# EAGLE board haasoscope_pro_fpga_board - before autoroute (EAGLE 9.6.2), part 1 of 2
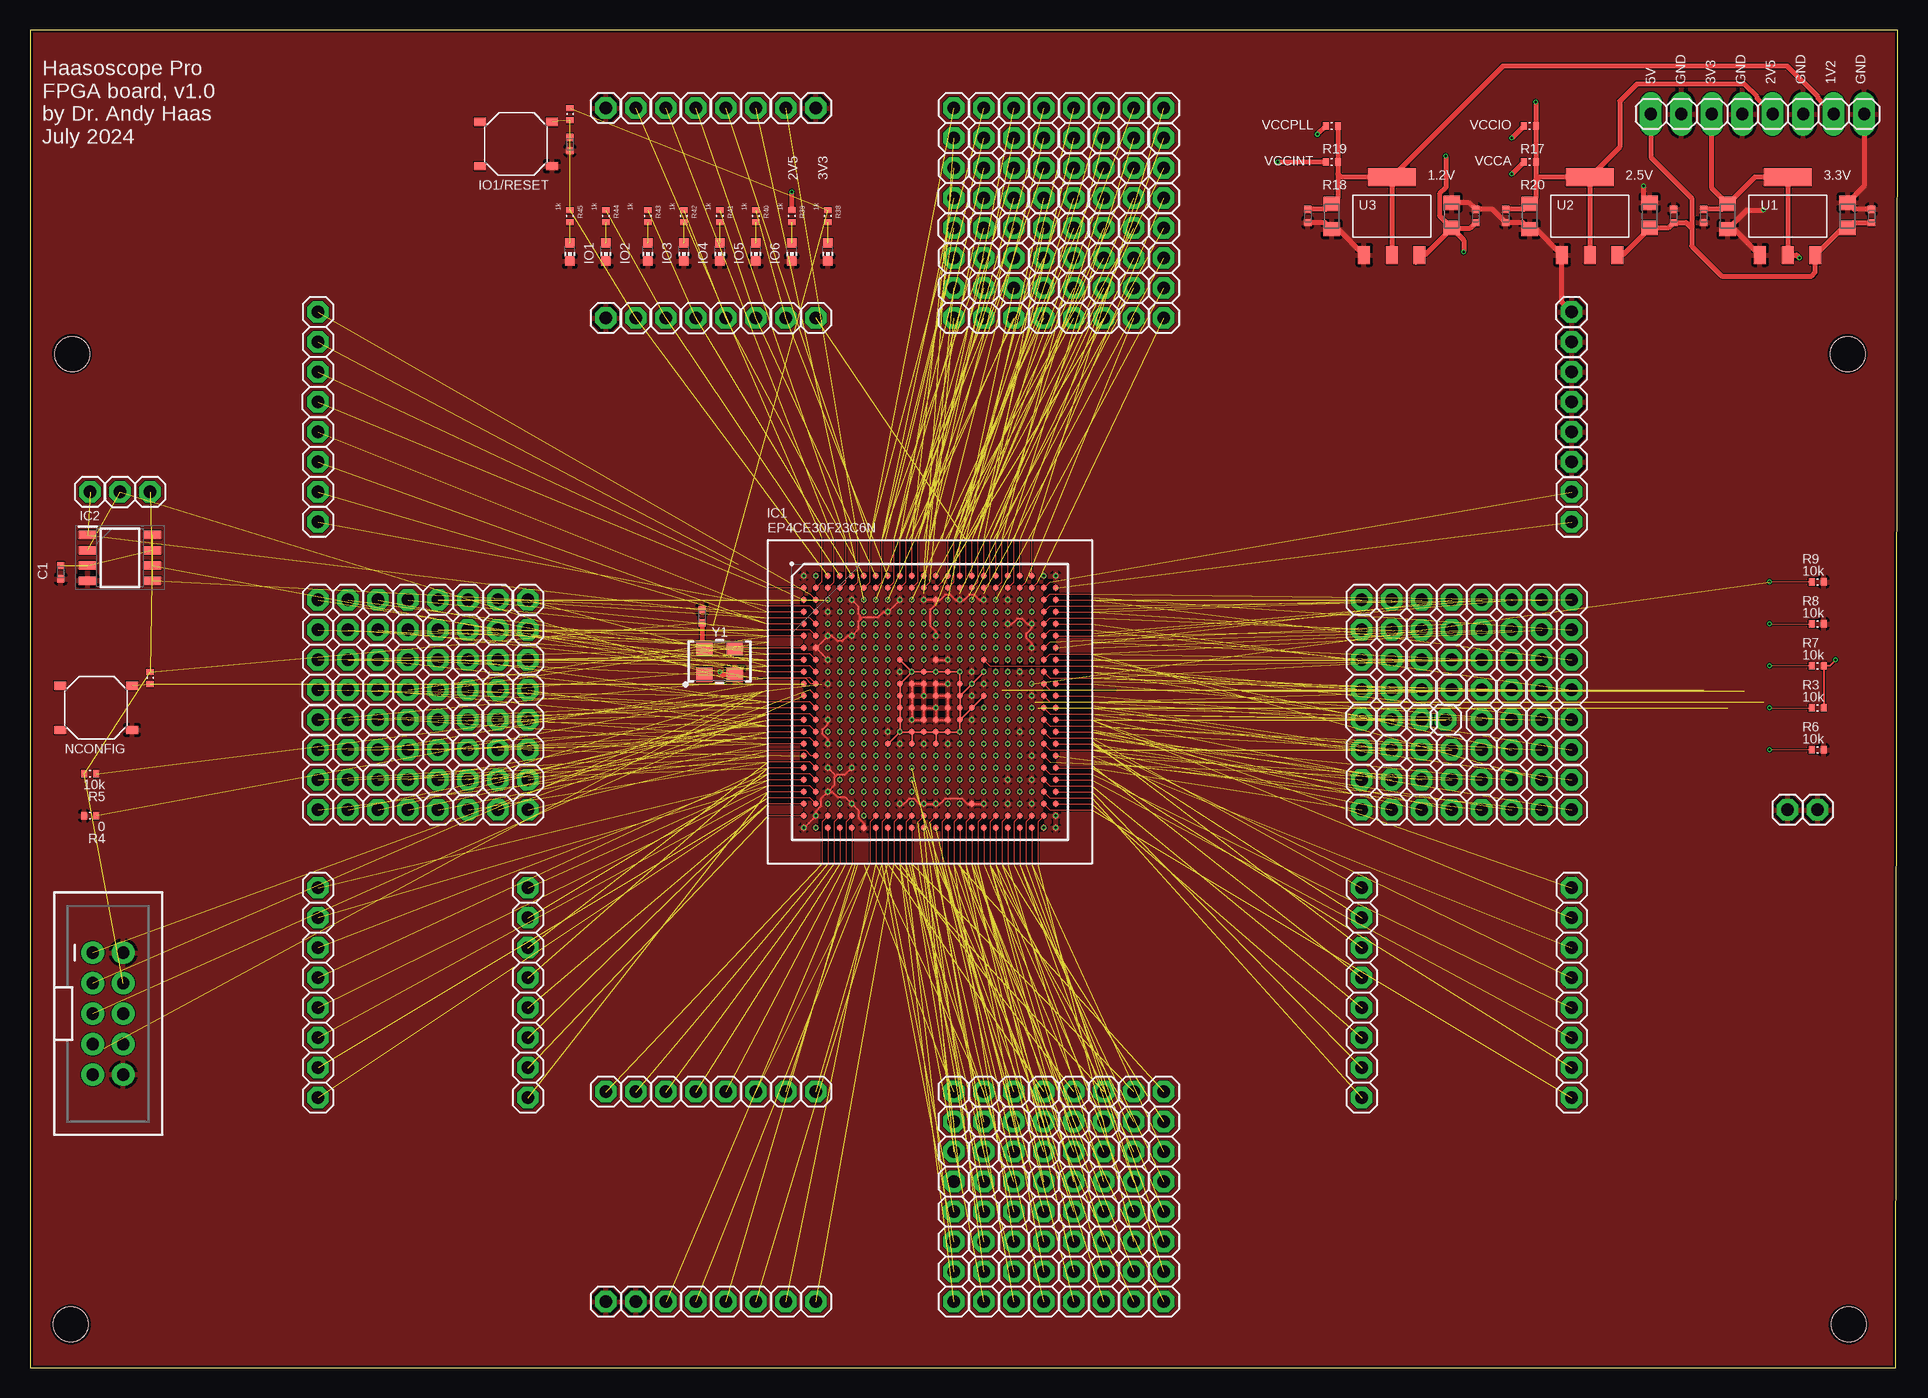
[diagram p4: board, top side]
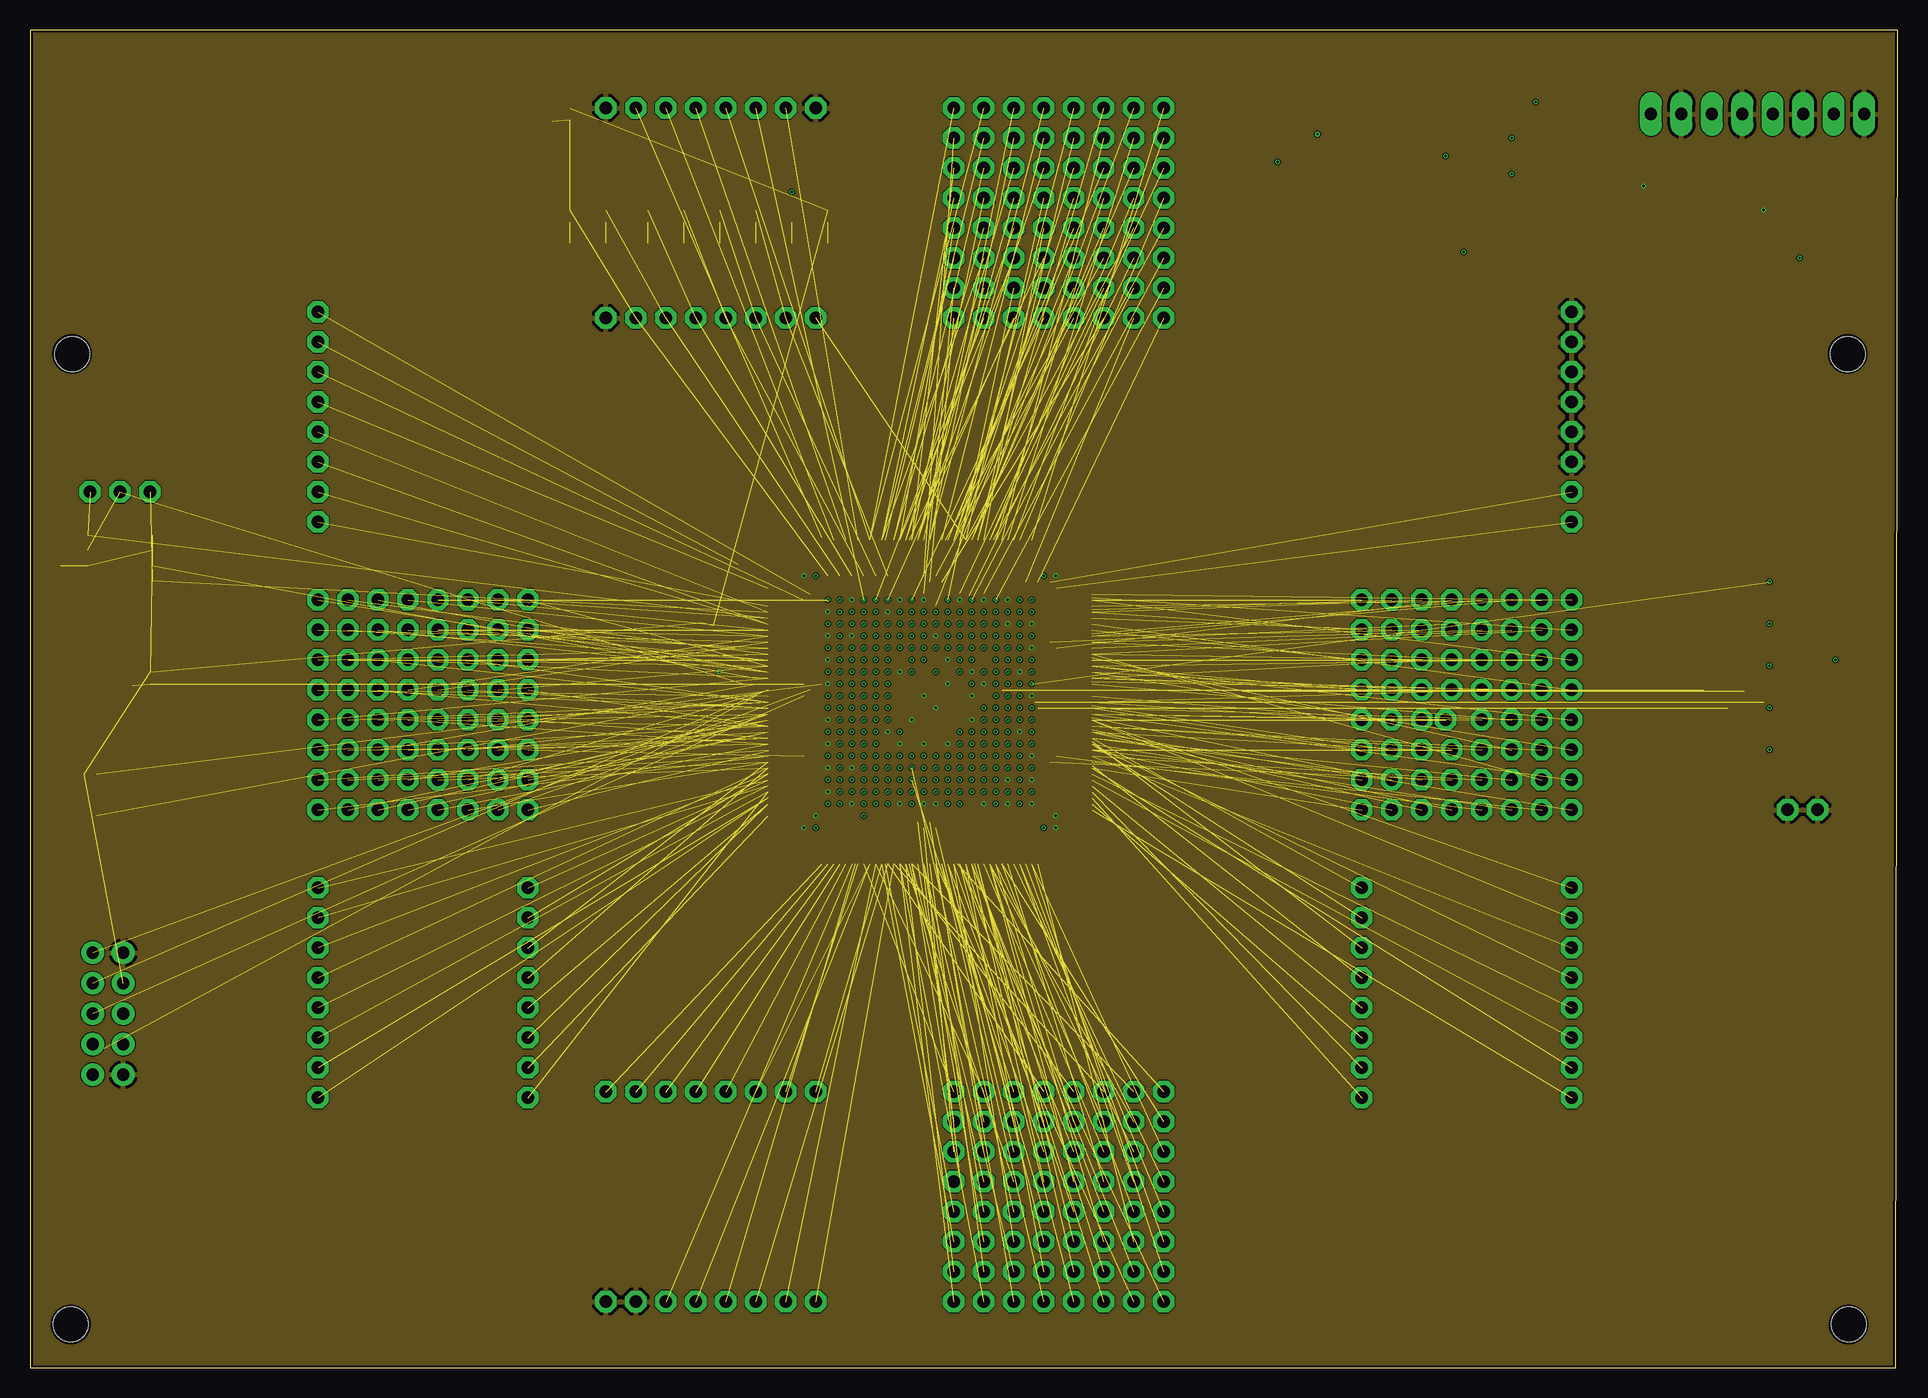
[diagram p5: board, inner layer topgnd]
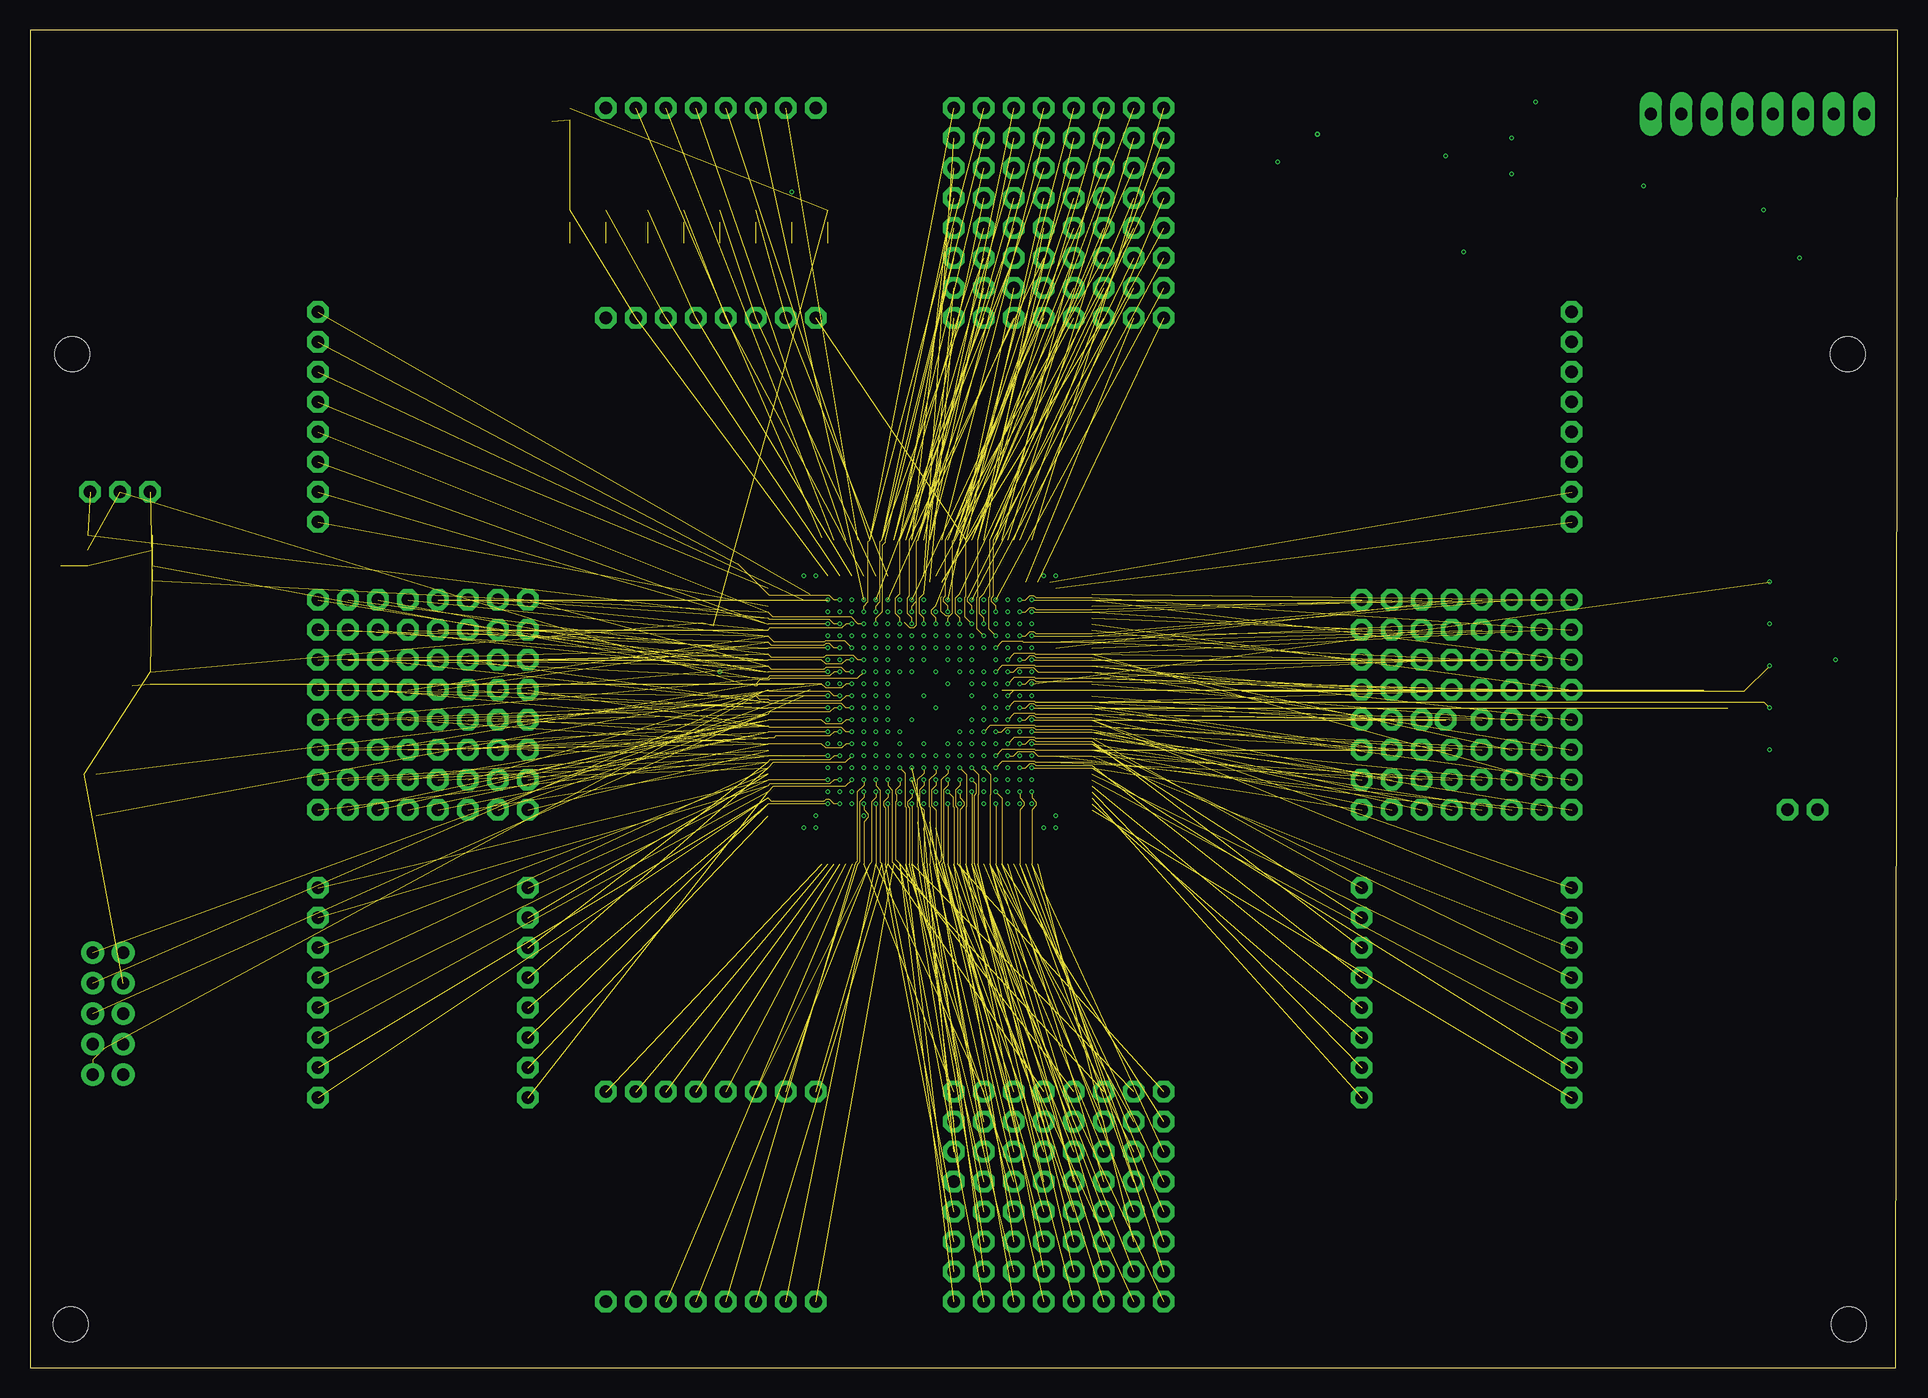
[diagram p6: board, inner layer sig2]
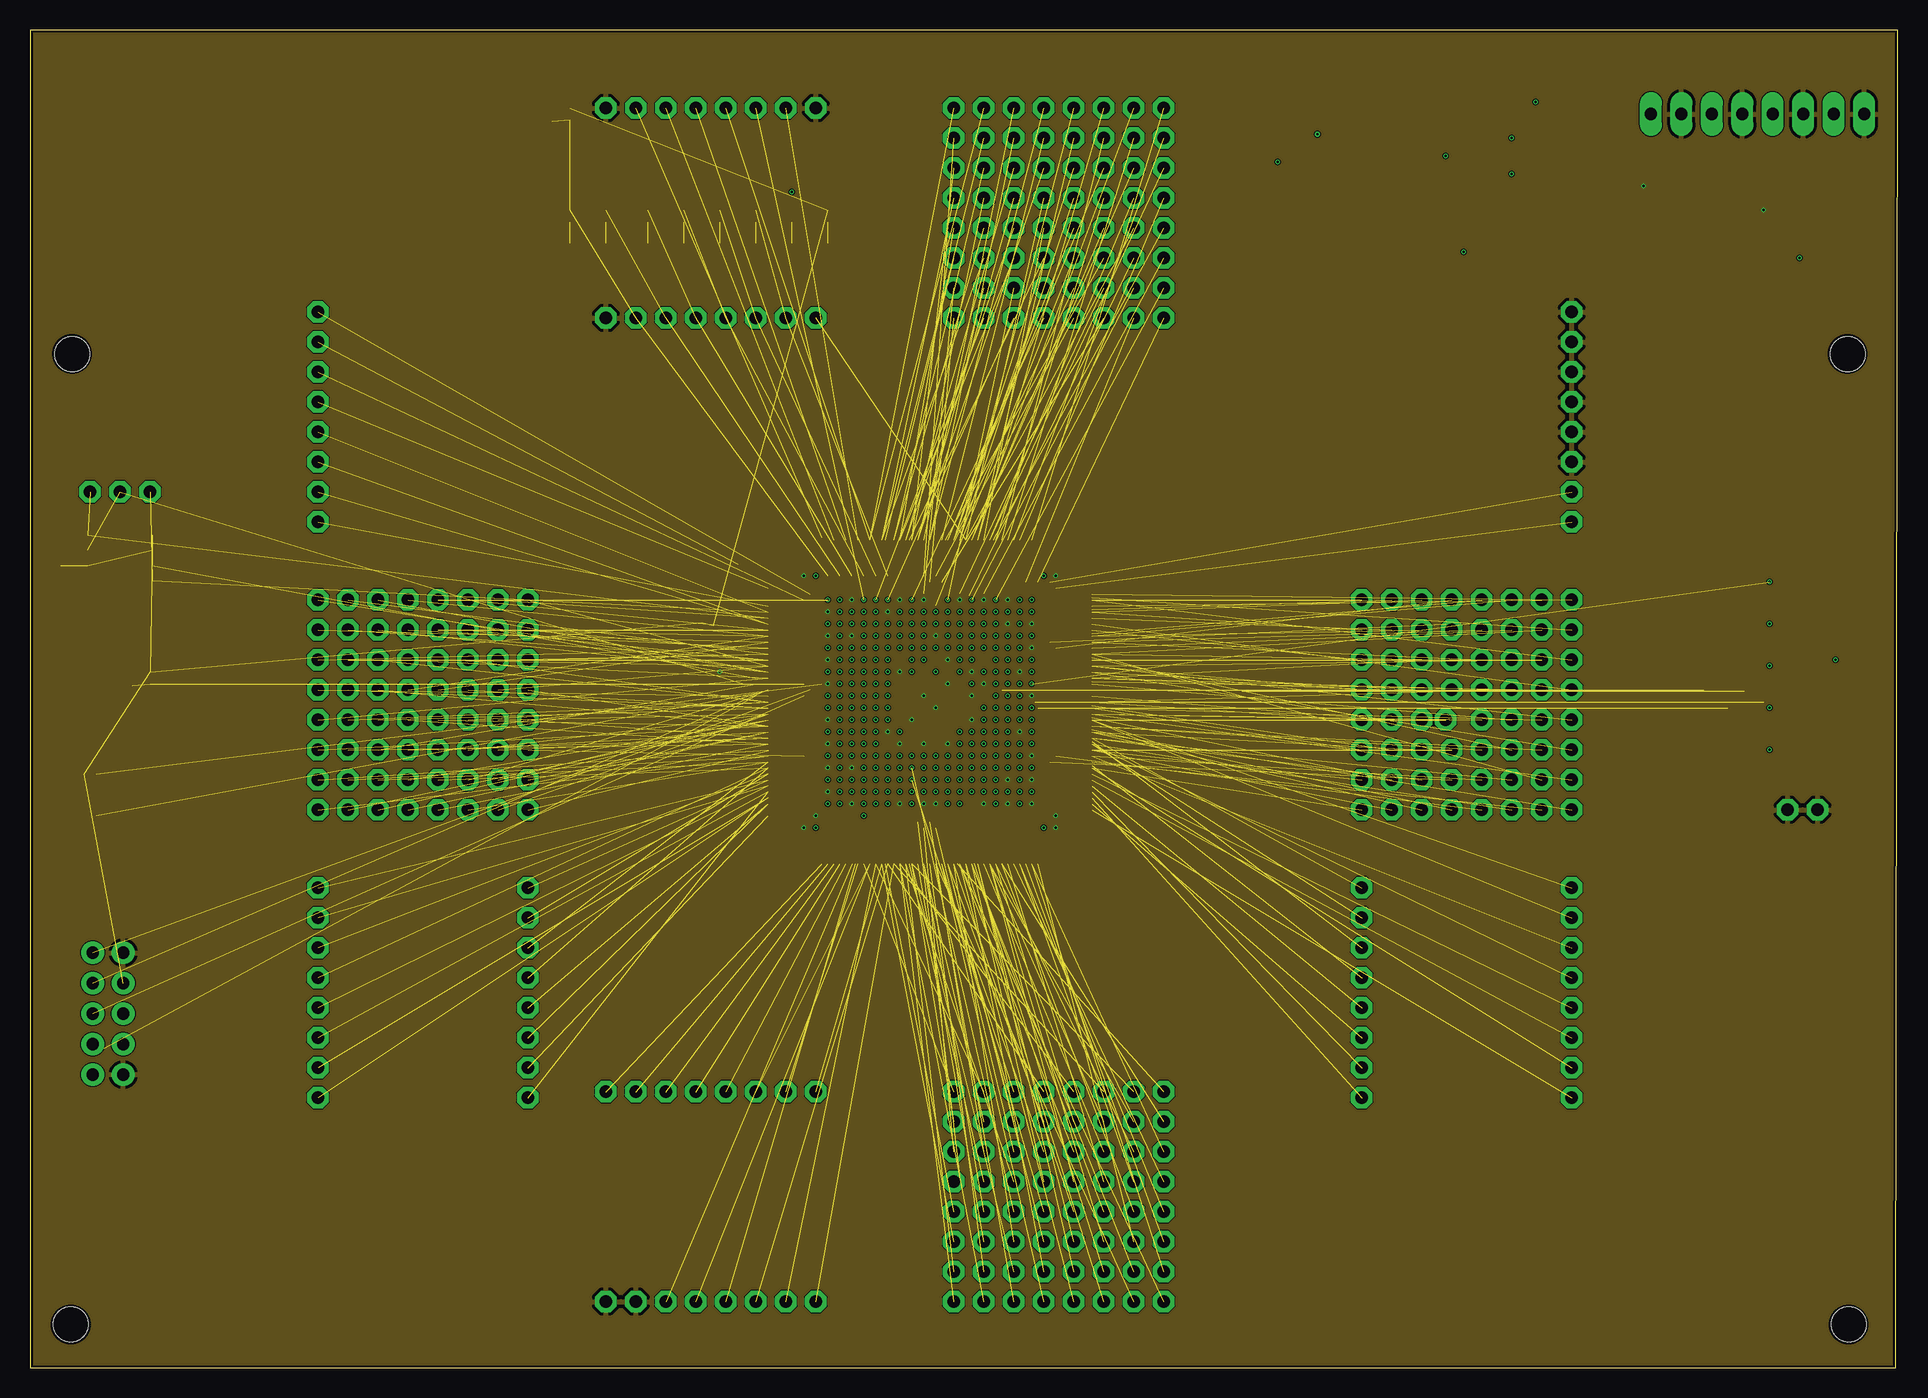
[diagram p7: board, inner layer sig2gnd]
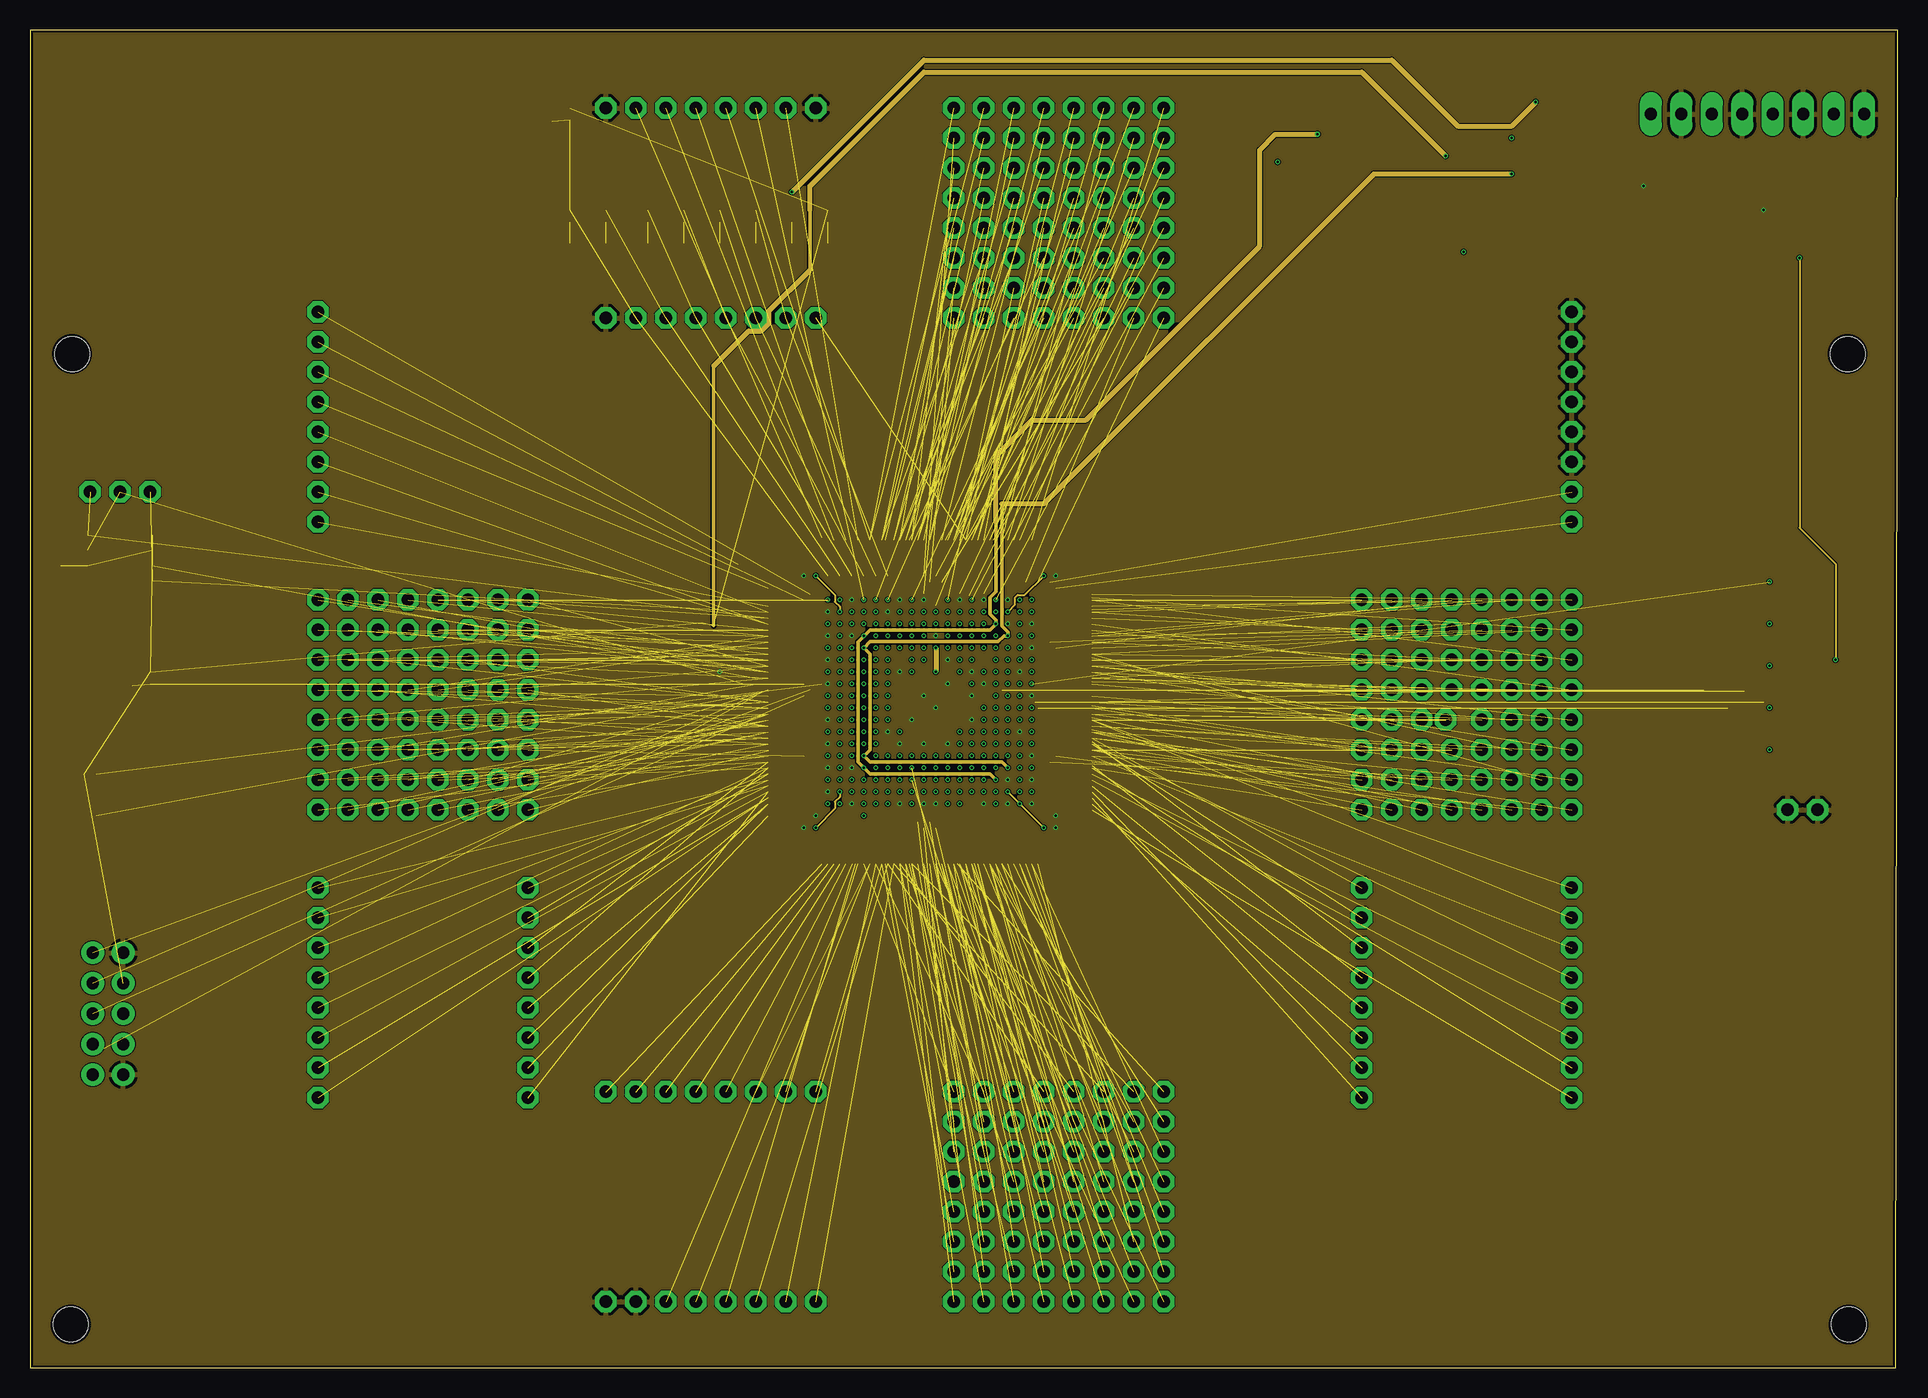
[diagram p8: board, inner layer pow1]
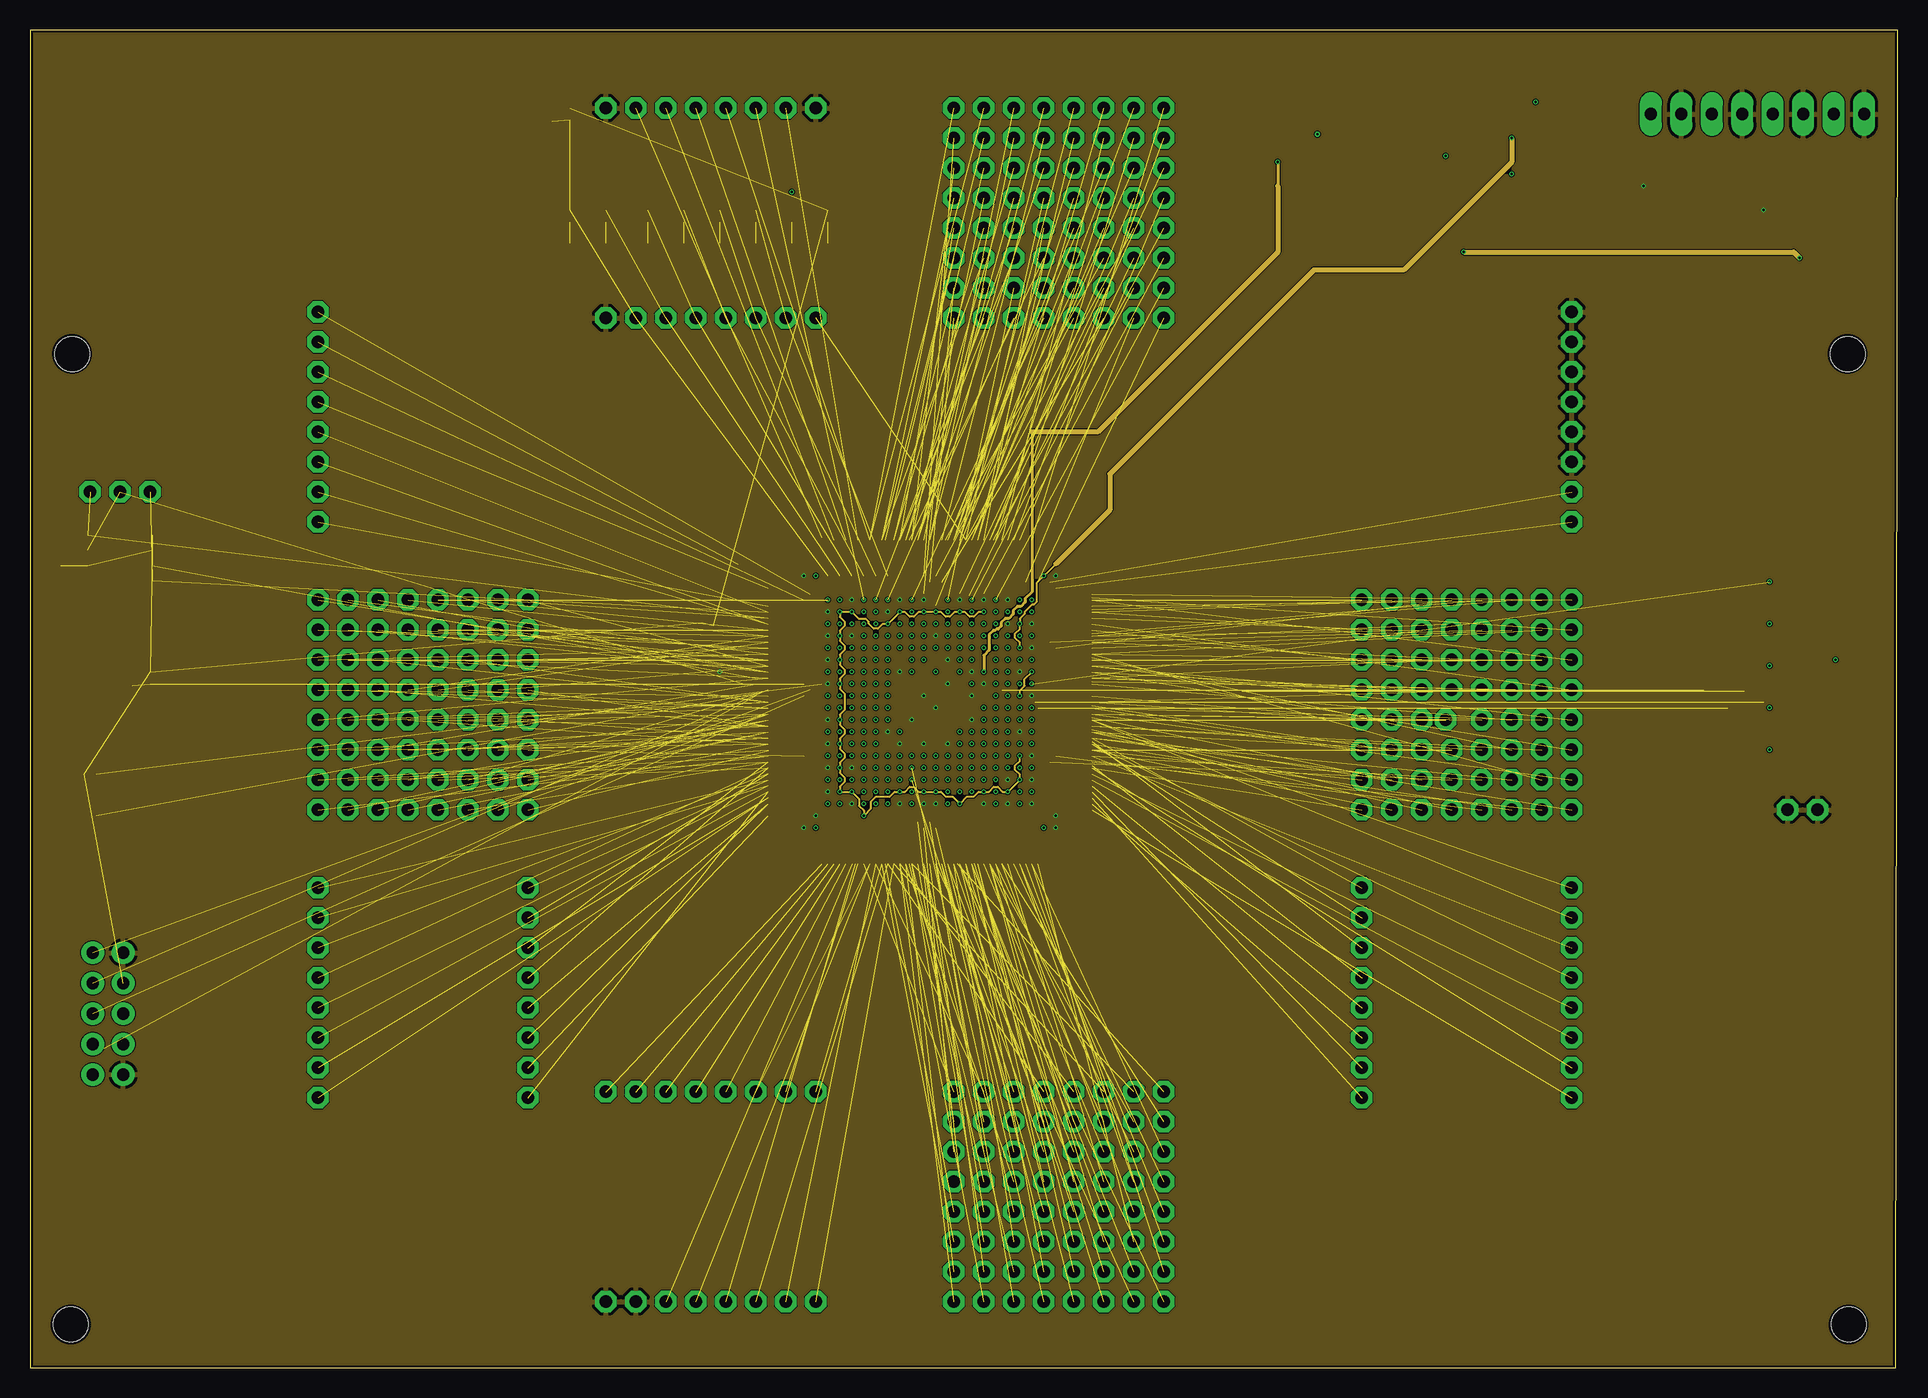
[diagram p9: board, inner layer pow2]
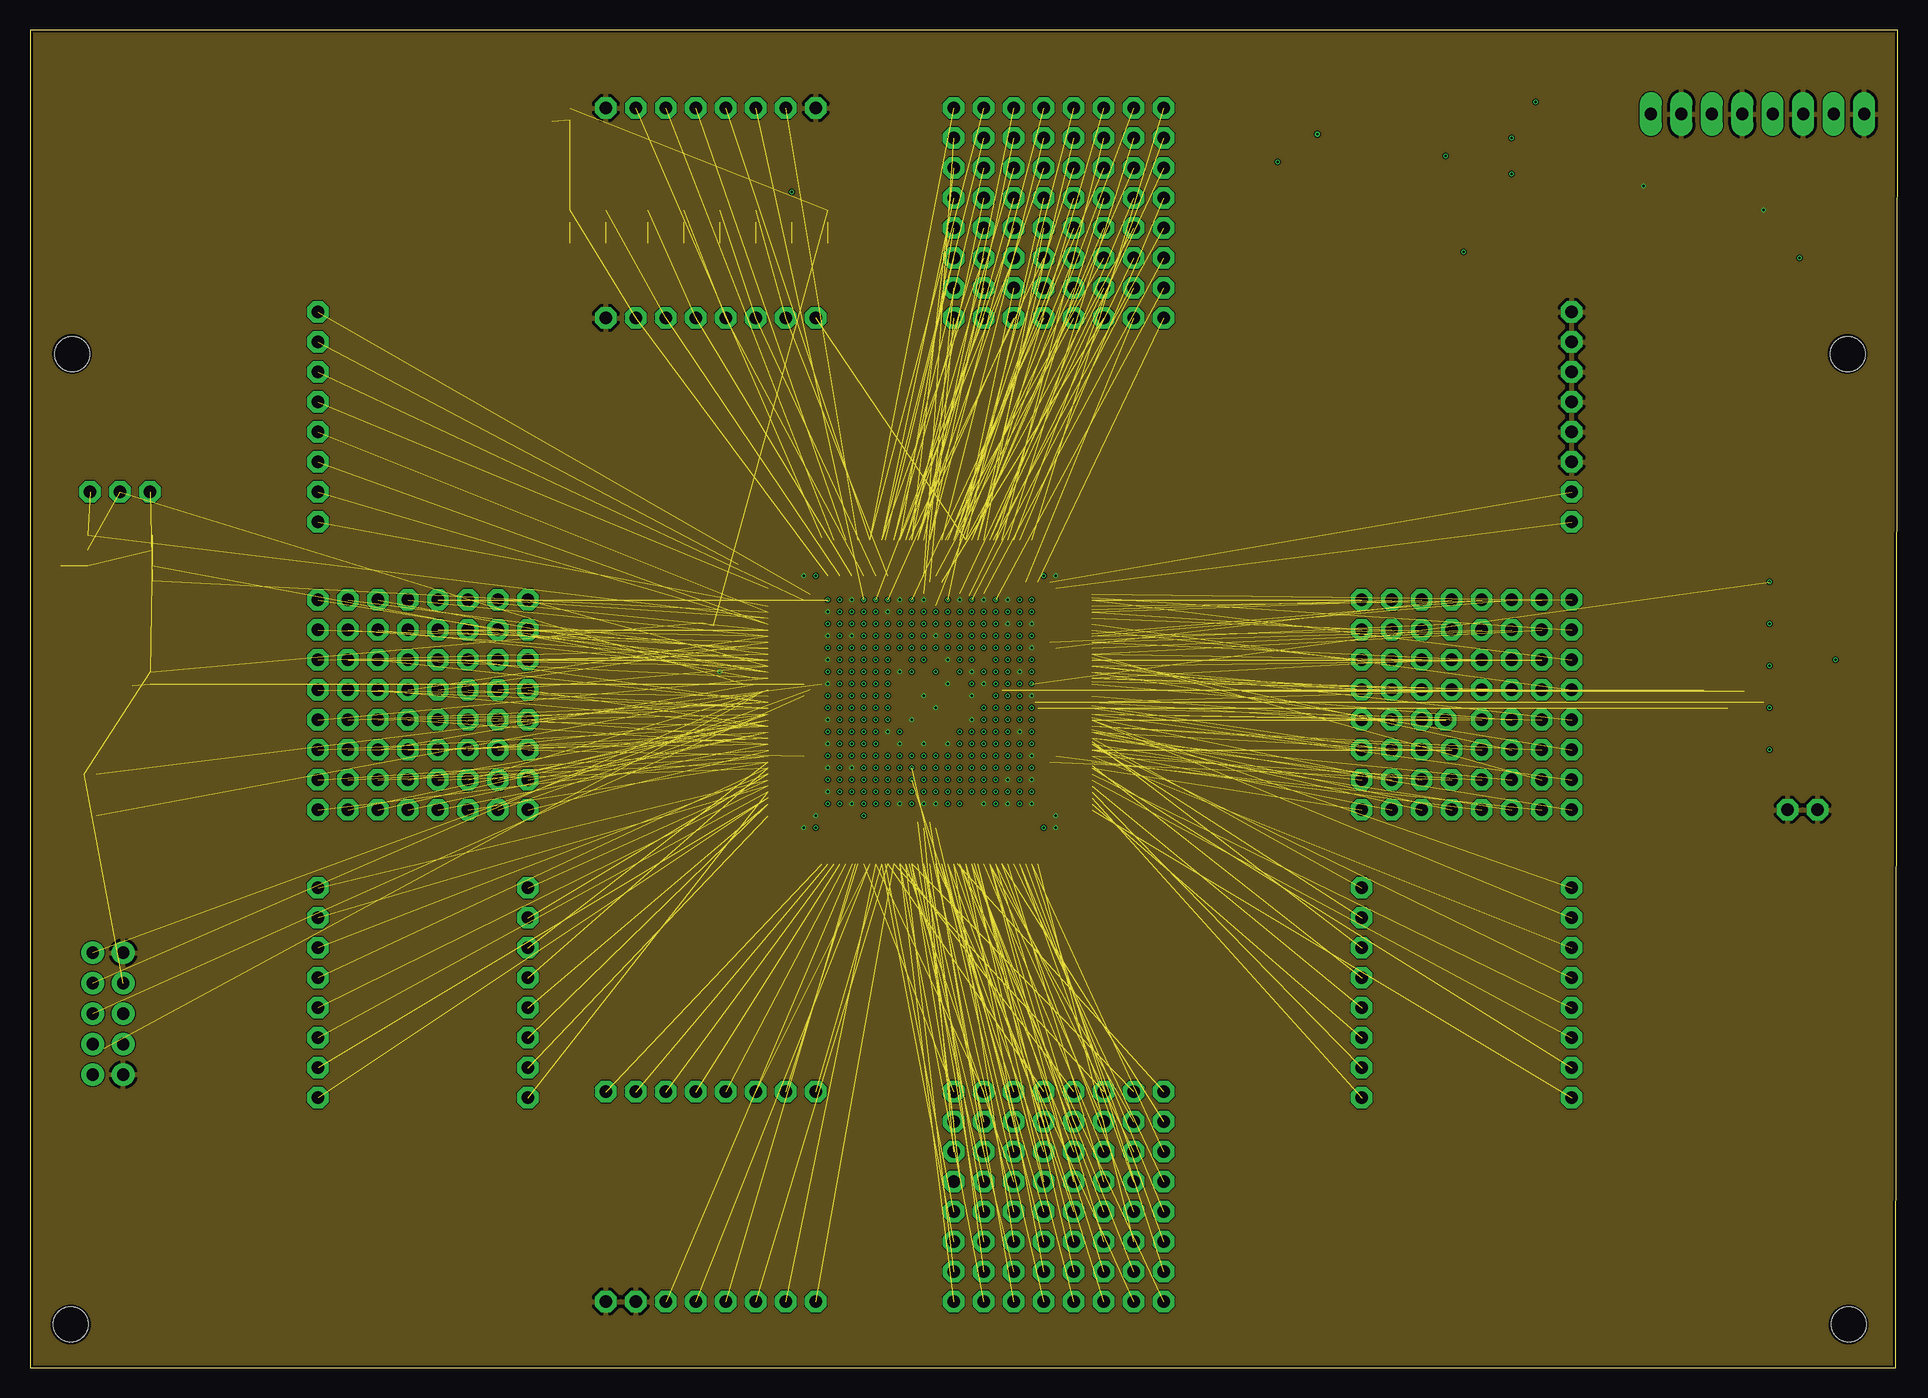
[diagram p10: board, inner layer sig4gnd]
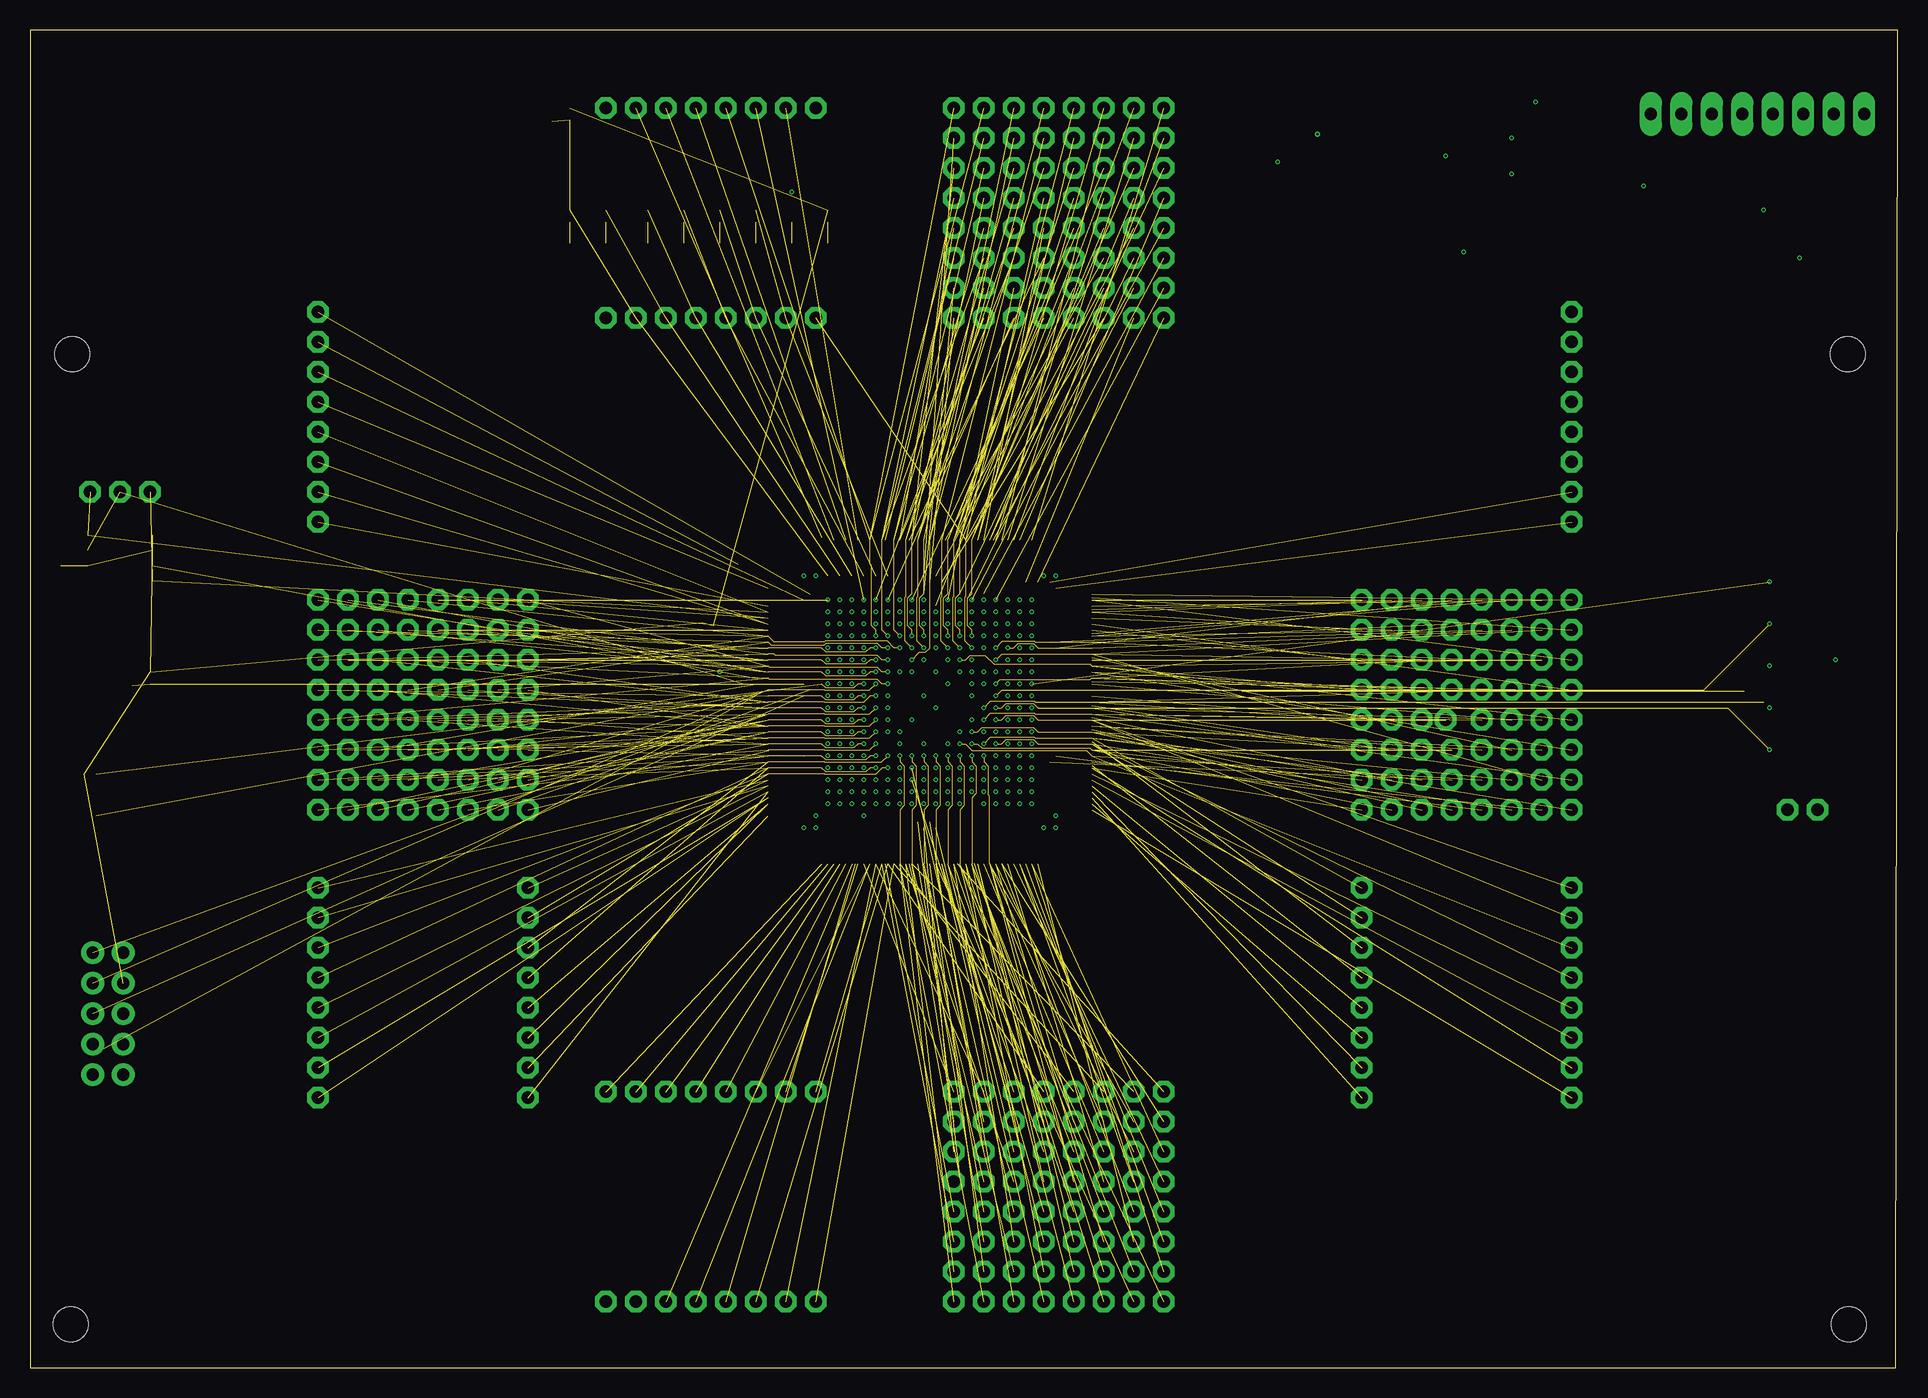
[diagram p11: board, inner layer sig4]
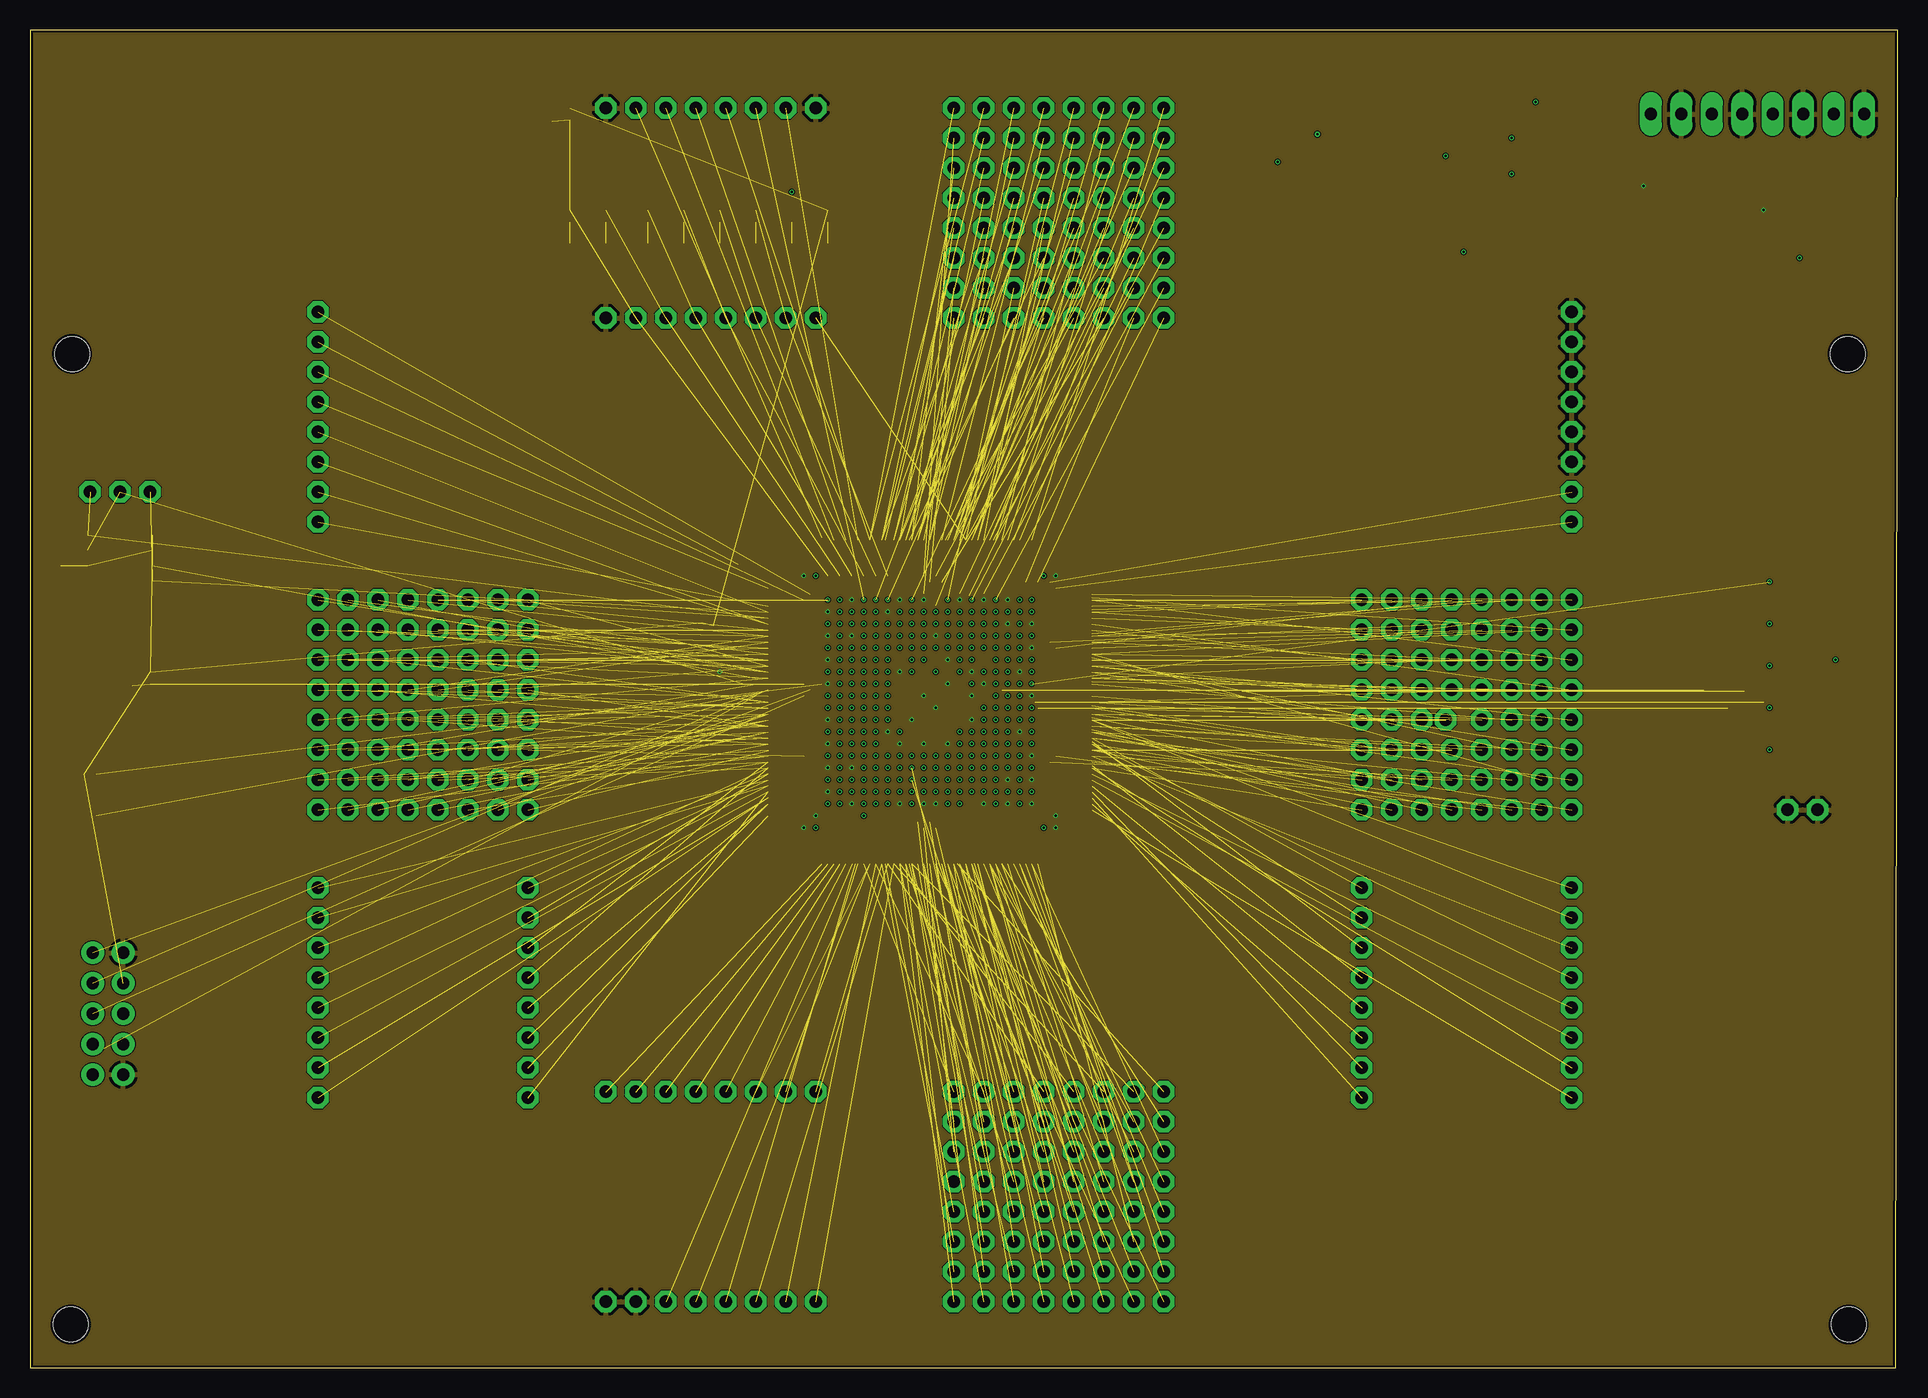
[diagram p12: board, inner layer sig5gnd]
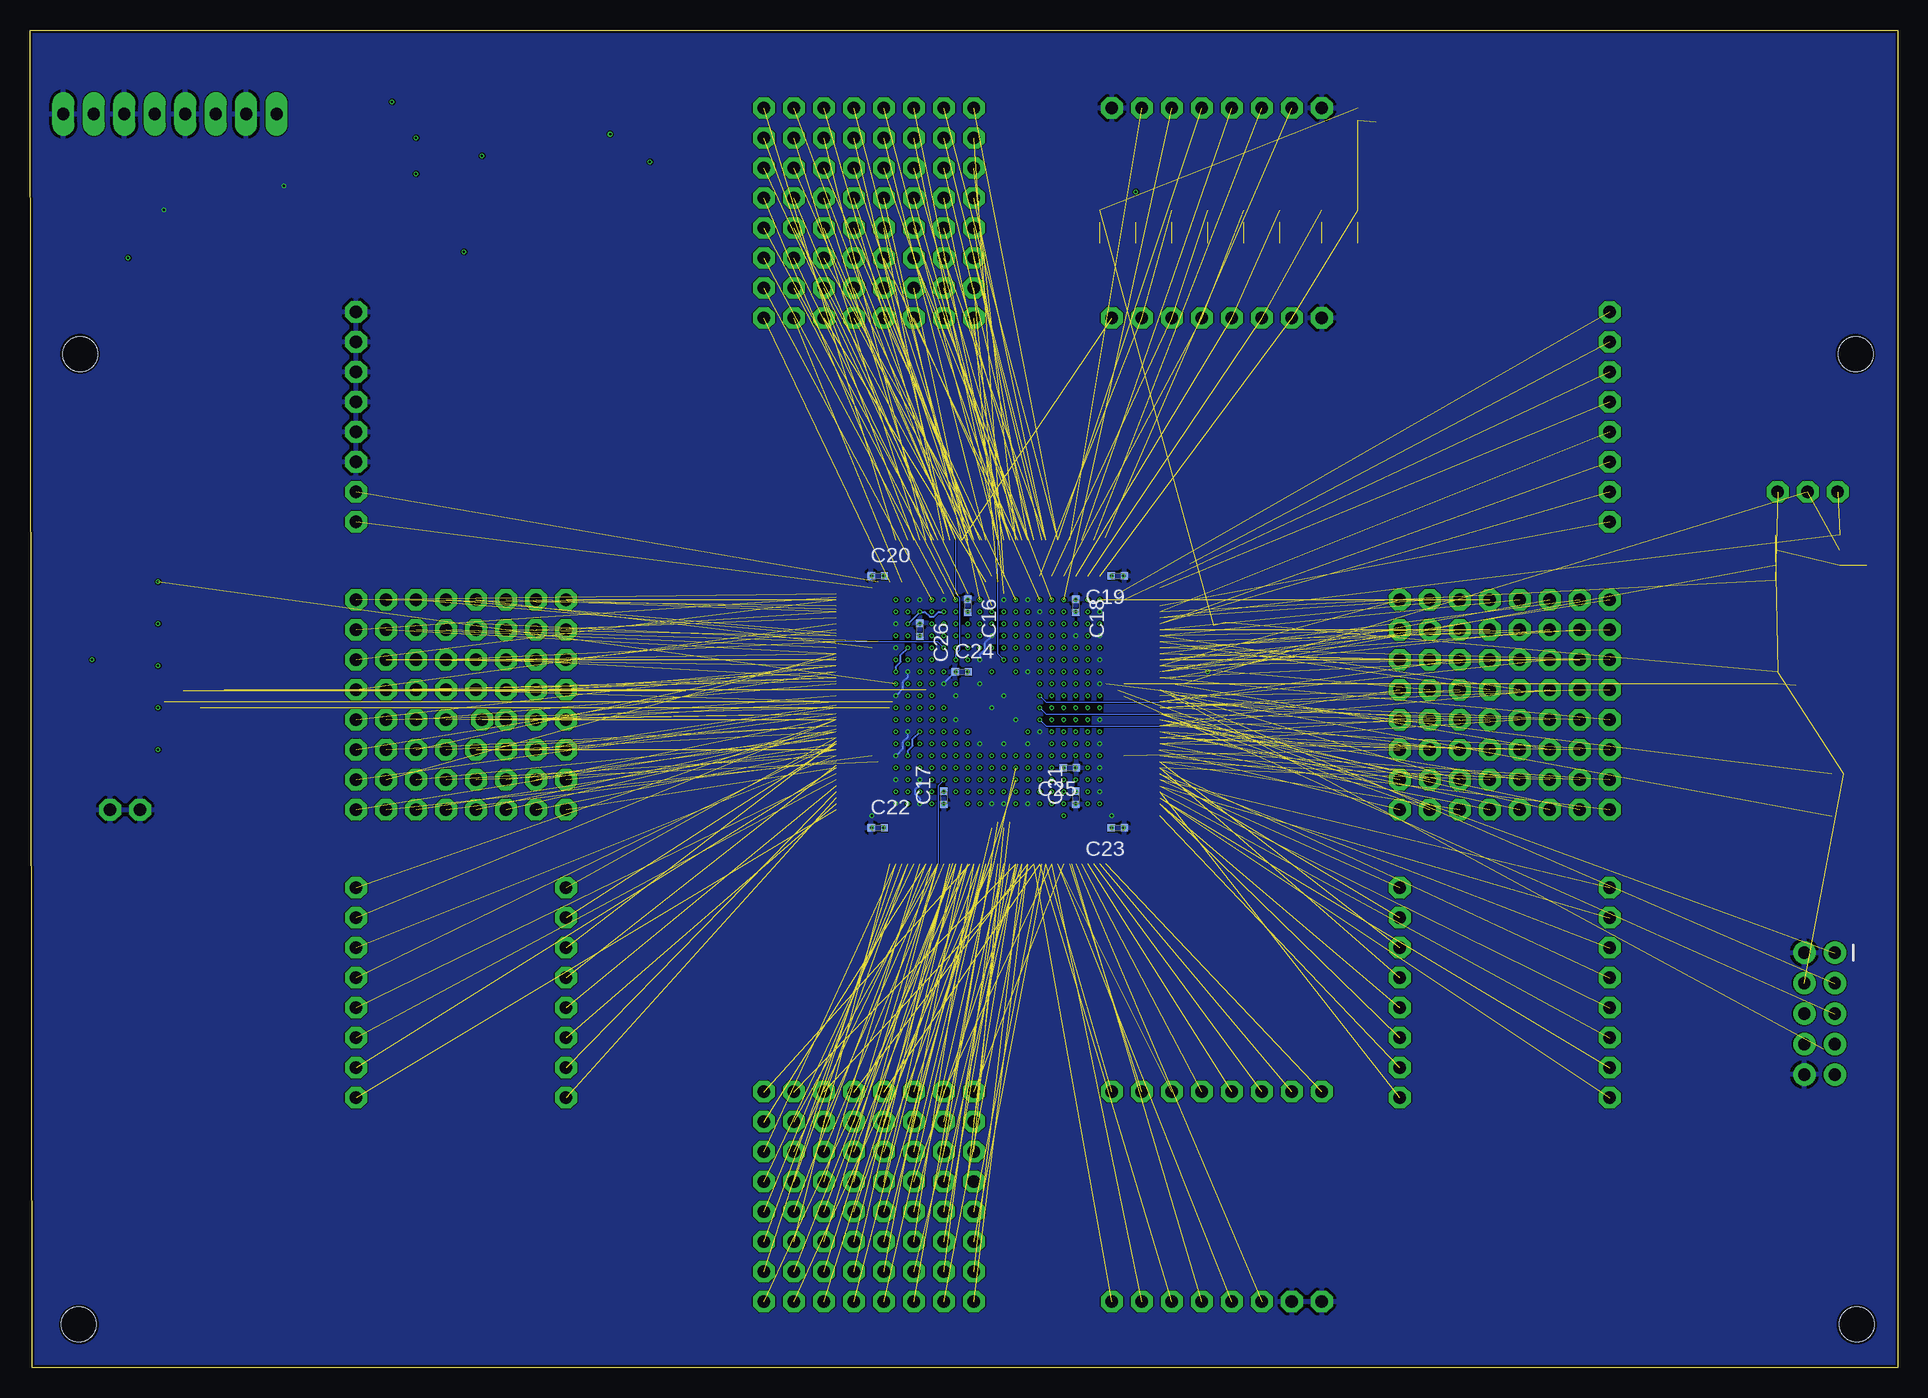
[diagram p13: board, bottom side, seen from below]

Size 155.67 x 111.5 mm. Coordinates in mm from the lower left corner, seen from the top.
Outline: 0,111.5 0,0 155.5,0 155.67,111.49 0,111.5
Copper layers (1+2*3+4*5+12*13+14*15+16): top 0.035mm / dielectric 0.2mm / topgnd 0.0175mm / dielectric 0.15mm / sig2 0.035mm / dielectric 0.2mm / sig2gnd 0.035mm / dielectric 0.15mm / pow1 0.035mm / dielectric 0.2mm / pow2 0.035mm / dielectric 0.15mm / sig4gnd 0.035mm / dielectric 0.2mm / sig4 0.035mm / dielectric 0.15mm / sig5gnd 0.0175mm / dielectric 0.2mm / sig5 0.035mm
Design rules "jlcpcb-10layers-haas": minimum track width 3.5mil, minimum drill 0.2mm, track to track 3.5mil, track to pad 5mil, pad to pad 5mil, via to via 0.5mm, smd to smd 5mil, copper to edge 0.2mm, drill to drill 6mil, minimum pad ring 10mil, minimum via ring 0.1mm, stop-mask expansion 0.05mm, vias tented up to drill 16mil, thermal gap 10mil
Net classes: 0 default: width 0.089 mm; 1 power: width 0.152 mm; 2 diffpair: width 0.089 mm; 3 loosediffpair: width 0.152 mm, clearance 0.305 mm to class 0, clearance 0.305 mm to class 1, clearance 0.305 mm to class 2, clearance 0.305 mm
Holes 2.9 mm at 3.4,3.6 151.6,3.6 3.5,84.5 151.5,84.5

## Footprints (pad centres in the part's own frame; a part is rotated, then mirrored left to right if it is on the bottom)
RESC0402_N = smd 0.6 x 0.6: 1 -0.55,0; 2 0.55,0
RESC0805_N = smd 1.2 x 1.35: 1 -1.1,0; 2 1,0
BGA484C100P22X22_2300X2300X240 = smd 0.5 x 0.5: A1 -10.5,10.5; A2 -9.5,10.5; A3 -8.5,10.5; A4 -7.5,10.5; A5 -6.5,10.5; A6 -5.5,10.5; A7 -4.5,10.5; A8 -3.5,10.5; A9 -2.5,10.5; A10 -1.5,10.5; A11 -0.5,10.5; A12 0.5,10.5; A13 1.5,10.5; A14 2.5,10.5; A15 3.5,10.5; A16 4.5,10.5; A17 5.5,10.5; A18 6.5,10.5; A19 7.5,10.5; A20 8.5,10.5; A21 9.5,10.5; A22 10.5,10.5; AA1 -10.5,-9.5; AA2 -9.5,-9.5; AA3 -8.5,-9.5; AA4 -7.5,-9.5; AA5 -6.5,-9.5; AA6 -5.5,-9.5; AA7 -4.5,-9.5; AA8 -3.5,-9.5; AA9 -2.5,-9.5; AA10 -1.5,-9.5; AA11 -0.5,-9.5; AA12 0.5,-9.5; AA13 1.5,-9.5; AA14 2.5,-9.5; AA15 3.5,-9.5; AA16 4.5,-9.5; AA17 5.5,-9.5; AA18 6.5,-9.5; AA19 7.5,-9.5; AA20 8.5,-9.5; AA21 9.5,-9.5; AA22 10.5,-9.5; AB1 -10.5,-10.5; AB2 -9.5,-10.5; AB3 -8.5,-10.5; AB4 -7.5,-10.5; AB5 -6.5,-10.5; AB6 -5.5,-10.5; AB7 -4.5,-10.5; AB8 -3.5,-10.5; AB9 -2.5,-10.5; AB10 -1.5,-10.5; AB11 -0.5,-10.5; AB12 0.5,-10.5; AB13 1.5,-10.5; AB14 2.5,-10.5; AB15 3.5,-10.5; AB16 4.5,-10.5; AB17 5.5,-10.5; AB18 6.5,-10.5; AB19 7.5,-10.5; AB20 8.5,-10.5; AB21 9.5,-10.5; AB22 10.5,-10.5; B1 -10.5,9.5; B2 -9.5,9.5; B3 -8.5,9.5; B4 -7.5,9.5; B5 -6.5,9.5; B6 -5.5,9.5; B7 -4.5,9.5; B8 -3.5,9.5; B9 -2.5,9.5; B10 -1.5,9.5; B11 -0.5,9.5; B12 0.5,9.5; B13 1.5,9.5; B14 2.5,9.5; B15 3.5,9.5; B16 4.5,9.5; B17 5.5,9.5; B18 6.5,9.5; B19 7.5,9.5; B20 8.5,9.5; B21 9.5,9.5; B22 10.5,9.5; C1 -10.5,8.5; C2 -9.5,8.5; C3 -8.5,8.5; C4 -7.5,8.5; C5 -6.5,8.5; C6 -5.5,8.5; C7 -4.5,8.5; C8 -3.5,8.5; C9 -2.5,8.5; C10 -1.5,8.5; C11 -0.5,8.5; C12 0.5,8.5; C13 1.5,8.5; C14 2.5,8.5; C15 3.5,8.5; C16 4.5,8.5; C17 5.5,8.5; C18 6.5,8.5; C19 7.5,8.5; C20 8.5,8.5; C21 9.5,8.5; C22 10.5,8.5; D1 -10.5,7.5; D2 -9.5,7.5; D3 -8.5,7.5; D4 -7.5,7.5; D5 -6.5,7.5; D6 -5.5,7.5; D7 -4.5,7.5; D8 -3.5,7.5; D9 -2.5,7.5; D10 -1.5,7.5; D11 -0.5,7.5; D12 0.5,7.5; D13 1.5,7.5; D14 2.5,7.5; D15 3.5,7.5; D16 4.5,7.5; D17 5.5,7.5; D18 6.5,7.5; D19 7.5,7.5; D20 8.5,7.5; D21 9.5,7.5; D22 10.5,7.5; E1 -10.5,6.5; E2 -9.5,6.5; E3 -8.5,6.5; E4 -7.5,6.5; E5 -6.5,6.5; E6 -5.5,6.5; E7 -4.5,6.5; E8 -3.5,6.5; E9 -2.5,6.5; E10 -1.5,6.5; E11 -0.5,6.5; E12 0.5,6.5; E13 1.5,6.5; E14 2.5,6.5; E15 3.5,6.5; E16 4.5,6.5; E17 5.5,6.5; E18 6.5,6.5; E19 7.5,6.5; E20 8.5,6.5; E21 9.5,6.5; E22 10.5,6.5; F1 -10.5,5.5; F2 -9.5,5.5; F3 -8.5,5.5; F4 -7.5,5.5; F5 -6.5,5.5; F6 -5.5,5.5; F7 -4.5,5.5; F8 -3.5,5.5; F9 -2.5,5.5; F10 -1.5,5.5; F11 -0.5,5.5; F12 0.5,5.5; F13 1.5,5.5; F14 2.5,5.5; F15 3.5,5.5; F16 4.5,5.5; F17 5.5,5.5; F18 6.5,5.5; F19 7.5,5.5; F20 8.5,5.5; F21 9.5,5.5; F22 10.5,5.5; G1 -10.5,4.5; G2 -9.5,4.5; G3 -8.5,4.5; G4 -7.5,4.5; G5 -6.5,4.5; G6 -5.5,4.5; G7 -4.5,4.5; G8 -3.5,4.5; G9 -2.5,4.5; G10 -1.5,4.5; G11 -0.5,4.5; G12 0.5,4.5; G13 1.5,4.5; G14 2.5,4.5; G15 3.5,4.5; G16 4.5,4.5; G17 5.5,4.5; G18 6.5,4.5; G19 7.5,4.5; G20 8.5,4.5; G21 9.5,4.5; G22 10.5,4.5; H1 -10.5,3.5; H2 -9.5,3.5; H3 -8.5,3.5; H4 -7.5,3.5; H5 -6.5,3.5; H6 -5.5,3.5; H7 -4.5,3.5; H8 -3.5,3.5; H9 -2.5,3.5; H10 -1.5,3.5; H11 -0.5,3.5; H12 0.5,3.5; H13 1.5,3.5; H14 2.5,3.5; H15 3.5,3.5; H16 4.5,3.5; H17 5.5,3.5; H18 6.5,3.5; H19 7.5,3.5; H20 8.5,3.5; H21 9.5,3.5; H22 10.5,3.5; J1 -10.5,2.5; J2 -9.5,2.5; J3 -8.5,2.5; J4 -7.5,2.5; J5 -6.5,2.5; J6 -5.5,2.5; J7 -4.5,2.5; J8 -3.5,2.5; J9 -2.5,2.5; J10 -1.5,2.5; J11 -0.5,2.5; J12 0.5,2.5; J13 1.5,2.5; J14 2.5,2.5; J15 3.5,2.5; J16 4.5,2.5; J17 5.5,2.5; J18 6.5,2.5; J19 7.5,2.5; J20 8.5,2.5; J21 9.5,2.5; J22 10.5,2.5; K1 -10.5,1.5; K2 -9.5,1.5; K3 -8.5,1.5; K4 -7.5,1.5; K5 -6.5,1.5; K6 -5.5,1.5; K7 -4.5,1.5; K8 -3.5,1.5; K9 -2.5,1.5; K10 -1.5,1.5; K11 -0.5,1.5; K12 0.5,1.5; K13 1.5,1.5; K14 2.5,1.5; K15 3.5,1.5; K16 4.5,1.5; K17 5.5,1.5; K18 6.5,1.5; K19 7.5,1.5; K20 8.5,1.5; K21 9.5,1.5; K22 10.5,1.5; L1 -10.5,0.5; L2 -9.5,0.5; L3 -8.5,0.5; L4 -7.5,0.5; L5 -6.5,0.5; L6 -5.5,0.5; L7 -4.5,0.5; L8 -3.5,0.5; L9 -2.5,0.5; L10 -1.5,0.5; L11 -0.5,0.5; L12 0.5,0.5; L13 1.5,0.5; L14 2.5,0.5; L15 3.5,0.5; L16 4.5,0.5; L17 5.5,0.5; L18 6.5,0.5; L19 7.5,0.5; L20 8.5,0.5; L21 9.5,0.5; L22 10.5,0.5; M1 -10.5,-0.5; M2 -9.5,-0.5; M3 -8.5,-0.5; M4 -7.5,-0.5; M5 -6.5,-0.5; M6 -5.5,-0.5; M7 -4.5,-0.5; M8 -3.5,-0.5; M9 -2.5,-0.5; M10 -1.5,-0.5; M11 -0.5,-0.5; M12 0.5,-0.5; M13 1.5,-0.5; M14 2.5,-0.5; M15 3.5,-0.5; M16 4.5,-0.5; M17 5.5,-0.5; M18 6.5,-0.5; M19 7.5,-0.5; M20 8.5,-0.5; M21 9.5,-0.5; M22 10.5,-0.5; N1 -10.5,-1.5; N2 -9.5,-1.5; N3 -8.5,-1.5; N4 -7.5,-1.5; N5 -6.5,-1.5; N6 -5.5,-1.5; N7 -4.5,-1.5; N8 -3.5,-1.5; N9 -2.5,-1.5; N10 -1.5,-1.5; N11 -0.5,-1.5; N12 0.5,-1.5; N13 1.5,-1.5; N14 2.5,-1.5; N15 3.5,-1.5; N16 4.5,-1.5; N17 5.5,-1.5; N18 6.5,-1.5; N19 7.5,-1.5; N20 8.5,-1.5; N21 9.5,-1.5; N22 10.5,-1.5; P1 -10.5,-2.5; P2 -9.5,-2.5; P3 -8.5,-2.5; P4 -7.5,-2.5; P5 -6.5,-2.5; P6 -5.5,-2.5; P7 -4.5,-2.5; P8 -3.5,-2.5; P9 -2.5,-2.5; P10 -1.5,-2.5; P11 -0.5,-2.5; P12 0.5,-2.5; P13 1.5,-2.5; P14 2.5,-2.5; P15 3.5,-2.5; P16 4.5,-2.5; P17 5.5,-2.5; P18 6.5,-2.5; P19 7.5,-2.5; P20 8.5,-2.5; P21 9.5,-2.5; P22 10.5,-2.5; R1 -10.5,-3.5; R2 -9.5,-3.5; R3 -8.5,-3.5; R4 -7.5,-3.5; R5 -6.5,-3.5; R6 -5.5,-3.5; R7 -4.5,-3.5; R8 -3.5,-3.5; R9 -2.5,-3.5; R10 -1.5,-3.5; R11 -0.5,-3.5; R12 0.5,-3.5; R13 1.5,-3.5; R14 2.5,-3.5; R15 3.5,-3.5; R16 4.5,-3.5; R17 5.5,-3.5; R18 6.5,-3.5; R19 7.5,-3.5; R20 8.5,-3.5; R21 9.5,-3.5; R22 10.5,-3.5; T1 -10.5,-4.5; T2 -9.5,-4.5; T3 -8.5,-4.5; T4 -7.5,-4.5; T5 -6.5,-4.5; T6 -5.5,-4.5; T7 -4.5,-4.5; T8 -3.5,-4.5; T9 -2.5,-4.5; T10 -1.5,-4.5; T11 -0.5,-4.5; T12 0.5,-4.5; T13 1.5,-4.5; T14 2.5,-4.5; T15 3.5,-4.5; T16 4.5,-4.5; T17 5.5,-4.5; T18 6.5,-4.5; T19 7.5,-4.5; T20 8.5,-4.5; T21 9.5,-4.5; T22 10.5,-4.5; U1 -10.5,-5.5; U2 -9.5,-5.5; U3 -8.5,-5.5; U4 -7.5,-5.5; U5 -6.5,-5.5; U6 -5.5,-5.5; U7 -4.5,-5.5; U8 -3.5,-5.5; U9 -2.5,-5.5; U10 -1.5,-5.5; U11 -0.5,-5.5; U12 0.5,-5.5; U13 1.5,-5.5; U14 2.5,-5.5; U15 3.5,-5.5; U16 4.5,-5.5; U17 5.5,-5.5; U18 6.5,-5.5; U19 7.5,-5.5; U20 8.5,-5.5; U21 9.5,-5.5; U22 10.5,-5.5; V1 -10.5,-6.5; V2 -9.5,-6.5; V3 -8.5,-6.5; V4 -7.5,-6.5; V5 -6.5,-6.5; V6 -5.5,-6.5; V7 -4.5,-6.5; V8 -3.5,-6.5; V9 -2.5,-6.5; V10 -1.5,-6.5; V11 -0.5,-6.5; V12 0.5,-6.5; V13 1.5,-6.5; V14 2.5,-6.5; V15 3.5,-6.5; V16 4.5,-6.5; V17 5.5,-6.5; V18 6.5,-6.5; V19 7.5,-6.5; V20 8.5,-6.5; V21 9.5,-6.5; V22 10.5,-6.5; W1 -10.5,-7.5; W2 -9.5,-7.5; W3 -8.5,-7.5; W4 -7.5,-7.5; W5 -6.5,-7.5; W6 -5.5,-7.5; W7 -4.5,-7.5; W8 -3.5,-7.5; W9 -2.5,-7.5; W10 -1.5,-7.5; W11 -0.5,-7.5; W12 0.5,-7.5; W13 1.5,-7.5; W14 2.5,-7.5; W15 3.5,-7.5; W16 4.5,-7.5; W17 5.5,-7.5; W18 6.5,-7.5; W19 7.5,-7.5; W20 8.5,-7.5; W21 9.5,-7.5; W22 10.5,-7.5; Y1 -10.5,-8.5; Y2 -9.5,-8.5; Y3 -8.5,-8.5; Y4 -7.5,-8.5; Y5 -6.5,-8.5; Y6 -5.5,-8.5; Y7 -4.5,-8.5; Y8 -3.5,-8.5; Y9 -2.5,-8.5; Y10 -1.5,-8.5; Y11 -0.5,-8.5; Y12 0.5,-8.5; Y13 1.5,-8.5; Y14 2.5,-8.5; Y15 3.5,-8.5; Y16 4.5,-8.5; Y17 5.5,-8.5; Y18 6.5,-8.5; Y19 7.5,-8.5; Y20 8.5,-8.5; Y21 9.5,-8.5; Y22 10.5,-8.5
SOIC127P600X175-8N = smd 1.5 x 0.7: 1 -2.7,1.905; 2 -2.7,0.635; 3 -2.7,-0.635; 4 -2.7,-1.905; 5 2.7,-1.905; 6 2.7,-0.635; 7 2.7,0.635; 8 2.7,1.905
2X5-SHROUDED = drill 1.016 pad 1.88: 1 -1.27,5.08; 2 1.27,5.08; 3 -1.27,2.54; 4 1.27,2.54; 5 -1.27,0; 6 1.27,0; 7 -1.27,-2.54; 8 1.27,-2.54; 9 -1.27,-5.08; 10 1.27,-5.08
1X01 = drill 1.016 octagon: 1 0,0
1X08 = drill 1.016 long: 1 -8.89,0; 2 -6.35,0; 3 -3.81,0; 4 -1.27,0; 5 1.27,0; 6 3.81,0; 7 6.35,0; 8 8.89,0
CHIP-LED0603 = smd 0.8 x 0.8: A 0,-0.75; C 0,0.75
RES-0402 = smd 0.5 x 0.6: P$1 -0.5,0; P$2 0.5,0
SW4-SMD-5.2X5.2X1.5MM = smd 1 x 0.7: 1 -3,1.85; 2 3,1.85; 3 -3,-1.85; 4 3,-1.85
SOT-223-3 = smd 1.5 x 4: P$1 3.25,0 | smd 1.5 x 1: P$2 -3.25,2.3; P$3 -3.25,0; P$4 -3.25,-2.3
OSCILLATOR-SMD-5X3.2 = smd 1.397 x 1.194: 1 -1.27,-1.1; 2 1.27,-1.1; 3 1.27,1.1; 4 -1.27,1.1

## Placement (x,y rotation side)
C1  0.1uF  [RESC0402_N]  2.56,66.3 90 top
C2  10uF  [RESC0805_N]  125,96 90 top
C3  0.1uF  [RESC0402_N]  123,96 90 top
C4  10uF  [RESC0805_N]  108.5,96 90 top
C5  0.1uF  [RESC0402_N]  106.5,96 90 top
C6  10uF  [RESC0805_N]  151.5,96 270 top
C7  0.1uF  [RESC0402_N]  153.5,96 270 top
C8  10uF  [RESC0805_N]  141.5,96 90 top
C9  0.1uF  [RESC0402_N]  139.5,96 90 top
C10  10uF  [RESC0805_N]  135,96 270 top
C11  0.1uF  [RESC0402_N]  137,96 270 top
C12  10uF  [RESC0805_N]  118.5,96 270 top
C13  0.1uF  [RESC0402_N]  120.5,96 270 top
C14  0.1uF  [RESC0402_N]  56.02,62.64 270 top
C15  0.1uF  [RESC0402_N]  45,102 90 top
C16  0.1uF  [RESC0402_N]  77.5,63.5 270 bottom
C17  0.1uF  [RESC0402_N]  79.5,47.5 90 bottom
C18  0.1uF  [RESC0402_N]  68.5,63.5 270 bottom
C19  0.1uF  [RESC0402_N]  65,66 180 bottom
C20  0.1uF  [RESC0402_N]  85,66 0 bottom
C21  0.1uF  [RESC0402_N]  68.5,47.5 90 bottom
C22  0.1uF  [RESC0402_N]  85,45 0 bottom
C23  0.1uF  [RESC0402_N]  65,45 180 bottom
C24  0.1uF  [RESC0402_N]  78,58 0 bottom
C25  0.1uF  [RESC0402_N]  69,50 180 bottom
C26  0.1uF  [RESC0402_N]  81.5,61.5 270 bottom
IC1  EP4CE30F23C6N  [BGA484C100P22X22_2300X2300X240]  75,55.5 0 top
IC2  EPCQ16ASI8N  [SOIC127P600X175-8N]  7.5,67.5 0 top
J1  2x5  [2X5-SHROUDED]  6.5,29.5 0 top
JP1  1  [1X01]  128.5,88 90 top
JP2  1  [1X01]  94.5,87.5 0 top
JP3  1x8  [1X08]  144,104.5 0 top
JP4  1  [1X01]  92,87.5 0 top
JP5  1  [1X01]  128.5,73 0 top
JP6  1  [1X01]  128.5,70.5 0 top
JP7  1  [1X01]  24,88 0 top
JP8  1  [1X01]  24,83 0 top
JP9  1  [1X01]  34,64 0 top
JP10  1  [1X01]  24,85.5 0 top
JP11  1  [1X01]  79.5,87.5 0 top
JP12  1  [1X01]  60.5,105 0 top
JP13  1  [1X01]  48,87.5 0 top
JP14  1  [1X01]  82,87.5 0 top
JP15  1  [1X01]  84.5,87.5 0 top
JP16  1  [1X01]  41.5,61.5 0 top
JP17  1  [1X01]  41.5,51.5 0 top
JP18  1  [1X01]  41.5,46.5 0 top
JP19  1  [1X01]  118.5,61.5 0 top
JP20  1  [1X01]  118.5,64 0 top
JP21  1  [1X01]  121,46.5 0 top
JP22  1  [1X01]  118.5,49 0 top
JP23  1  [1X01]  87,87.5 0 top
JP24  1  [1X01]  89.5,87.5 0 top
JP25  1  [1X01]  77,87.5 0 top
JP26  1  [1X01]  77,102.5 0 top
JP27  1  [1X01]  82,18 0 top
JP28  1  [1X01]  79.5,18 0 top
JP29  1  [1X01]  77,15.5 0 top
JP30  1  [1X01]  77,18 0 top
JP31  1  [1X01]  128.5,80.5 90 top
JP32  1  [1X01]  82,90 0 top
JP33  1  [1X01]  94.5,90 0 top
JP34  1  [1X01]  92,90 0 top
JP35  1  [1X01]  128.5,61.5 0 top
JP36  1  [1X01]  111,64 0 top
JP37  1  [1X01]  128.5,59 0 top
JP38  1  [1X01]  128.5,64 0 top
JP39  1  [1X01]  10,73 0 top
JP40  1  [1X01]  24,70.5 0 top
JP41  1  [1X01]  79.5,92.5 0 top
JP42  1  [1X01]  77,105 0 top
JP43  1  [1X01]  79.5,90 0 top
JP44  1  [1X01]  89.5,92.5 0 top
JP45  1  [1X01]  128.5,85.5 90 top
JP46  1  [1X01]  65.5,105 0 top
JP47  1  [1X01]  94.5,95 0 top
JP48  1  [1X01]  92,92.5 0 top
JP49  1  [1X01]  113.5,64 0 top
JP50  1  [1X01]  116,64 0 top
JP51  1  [1X01]  111,61.5 0 top
JP52  1  [1X01]  126,64 0 top
JP53  1  [1X01]  24,73 0 top
JP54  1  [1X01]  5,73 0 top
JP55  1  [1X01]  39,64 0 top
JP56  1  [1X01]  24,75.5 0 top
JP57  1  [1X01]  48,105 0 top
JP58  1  [1X01]  36.5,64 0 top
JP59  1  [1X01]  24,78 0 top
JP60  1  [1X01]  77,92.5 0 top
JP61  1  [1X01]  84.5,92.5 0 top
JP62  1  [1X01]  82,92.5 0 top
JP63  1  [1X01]  77,90 0 top
JP64  1  [1X01]  87,92.5 0 top
JP65  1  [1X01]  89.5,90 0 top
JP66  1  [1X01]  84.5,90 0 top
JP67  1  [1X01]  92,95 0 top
JP68  1  [1X01]  94.5,92.5 0 top
JP69  1  [1X01]  128.5,56.5 0 top
JP70  1  [1X01]  113.5,61.5 0 top
JP71  1  [1X01]  31.5,64 0 top
JP72  1  [1X01]  34,61.5 0 top
JP73  1  [1X01]  128.5,83 90 top
JP74  1  [1X01]  50.5,87.5 90 top
JP75  1  [1X01]  55.5,87.5 90 top
JP76  1  [1X01]  53,87.5 90 top
JP77  1  [1X01]  58,87.5 90 top
JP78  1  [1X01]  60.5,87.5 90 top
JP79  1  [1X01]  77,95 90 top
JP80  1  [1X01]  63,87.5 90 top
JP81  1  [1X01]  79.5,97.5 90 top
JP82  1  [1X01]  87,95 90 top
JP83  1  [1X01]  89.5,95 90 top
JP84  1  [1X01]  87,97.5 90 top
JP85  1  [1X01]  84.5,95 90 top
JP86  1  [1X01]  89.5,97.5 90 top
JP87  1  [1X01]  94.5,97.5 90 top
JP88  1  [1X01]  92,102.5 90 top
JP89  1  [1X01]  94.5,105 90 top
JP90  1  [1X01]  24,80.5 90 top
JP91  1  [1X01]  53,105 90 top
JP92  1  [1X01]  50.5,105 90 top
JP93  1  [1X01]  55.5,105 90 top
JP94  1  [1X01]  63,105 90 top
JP95  1  [1X01]  77,97.5 90 top
JP96  1  [1X01]  58,105 90 top
JP97  1  [1X01]  79.5,95 90 top
JP98  1  [1X01]  82,95 90 top
JP99  1  [1X01]  87,100 90 top
JP100  1  [1X01]  82,97.5 90 top
JP101  1  [1X01]  84.5,97.5 90 top
JP102  1  [1X01]  87,102.5 90 top
JP103  1  [1X01]  89.5,102.5 90 top
JP104  1  [1X01]  94.5,100 90 top
JP105  1  [1X01]  94.5,102.5 90 top
JP106  1  [1X01]  29,51.5 90 top
JP107  1  [1X01]  41.5,64 90 top
JP108  1  [1X01]  29,61.5 90 top
JP109  1  [1X01]  128.5,54 90 top
JP110  1  [1X01]  116,56.5 90 top
JP111  1  [1X01]  128.5,51.5 90 top
JP112  1  [1X01]  116,59 90 top
JP113  1  [1X01]  7.5,73 90 top
JP114  1  [1X01]  36.5,49 90 top
JP115  1  [1X01]  113.5,56.5 90 top
JP116  1  [1X01]  24,54 90 top
JP117  1  [1X01]  123.5,56.5 90 top
JP118  1  [1X01]  126,56.5 90 top
JP119  1  [1X01]  123.5,54 90 top
JP120  1  [1X01]  118.5,56.5 90 top
JP121  1  [1X01]  24,56.5 90 top
JP122  1  [1X01]  29,59 90 top
JP123  1  [1X01]  121,56.5 90 top
JP124  1  [1X01]  26.5,54 90 top
JP125  1  [1X01]  113.5,54 90 top
JP126  1  [1X01]  29,54 90 top
JP127  1  [1X01]  26.5,56.5 90 top
JP128  1  [1X01]  36.5,59 90 top
JP129  1  [1X01]  39,49 90 top
JP130  1  [1X01]  36.5,54 90 top
JP131  1  [1X01]  36.5,51.5 90 top
JP132  1  [1X01]  36.5,56.5 90 top
JP133  1  [1X01]  39,54 90 top
JP134  1  [1X01]  111,54 90 top
JP135  1  [1X01]  126,54 90 top
JP136  1  [1X01]  113.5,51.5 90 top
JP137  1  [1X01]  116,54 90 top
JP138  1  [1X01]  48,5.5 0 top
JP139  1  [1X01]  79.5,102.5 0 top
JP140  1  [1X01]  79.5,105 0 top
JP141  1  [1X01]  79.5,100 0 top
JP142  1  [1X01]  77,100 0 top
JP143  1  [1X01]  89.5,100 0 top
JP144  1  [1X01]  82,105 0 top
JP145  1  [1X01]  87,105 0 top
JP146  1  [1X01]  92,105 0 top
JP147  1  [1X01]  92,97.5 0 top
JP148  1  [1X01]  89.5,105 0 top
JP149  1  [1X01]  128.5,75.5 90 top
JP150  1  [1X01]  121,64 0 top
JP151  1  [1X01]  116,61.5 0 top
JP152  1  [1X01]  111,59 0 top
JP153  1  [1X01]  31.5,61.5 0 top
JP154  1  [1X01]  123.5,64 0 top
JP155  1  [1X01]  24,61.5 0 top
JP156  1  [1X01]  31.5,56.5 0 top
JP157  1  [1X01]  34,56.5 0 top
JP158  1  [1X01]  24,59 0 top
JP159  1  [1X01]  39,61.5 0 top
JP160  1  [1X01]  82,100 0 top
JP161  1  [1X01]  84.5,102.5 0 top
JP162  1  [1X01]  84.5,100 0 top
JP163  1  [1X01]  87,90 0 top
JP164  1  [1X01]  65.5,87.5 0 top
JP165  1  [1X01]  146.5,46.5 0 top
JP166  1  [1X01]  128.5,78 90 top
JP167  1  [1X01]  121,61.5 0 top
JP168  1  [1X01]  121,59 0 top
JP169  1  [1X01]  123.5,61.5 0 top
JP170  1  [1X01]  26.5,61.5 0 top
JP171  1  [1X01]  26.5,59 0 top
JP172  1  [1X01]  41.5,59 0 top
JP173  1  [1X01]  39,59 0 top
JP174  1  [1X01]  36.5,61.5 0 top
JP175  1  [1X01]  84.5,105 0 top
JP176  1  [1X01]  26.5,64 0 top
JP177  1  [1X01]  50.5,5.5 0 top
JP178  1  [1X01]  82,102.5 0 top
JP179  1  [1X01]  111,56.5 0 top
JP180  1  [1X01]  92,100 0 top
JP181  1  [1X01]  118.5,59 0 top
JP182  1  [1X01]  123.5,59 0 top
JP183  1  [1X01]  126,49 0 top
JP184  1  [1X01]  123.5,51.5 0 top
JP185  1  [1X01]  126,61.5 0 top
JP186  1  [1X01]  113.5,59 0 top
JP187  1  [1X01]  126,59 0 top
JP188  1  [1X01]  29,64 0 top
JP189  1  [1X01]  24,64 0 top
JP190  1  [1X01]  34,59 0 top
JP191  1  [1X01]  31.5,59 0 top
JP192  1  [1X01]  39,56.5 0 top
JP193  1  [1X01]  149,46.5 0 top
JP194  1  [1X01]  111,51.5 0 top
JP195  1  [1X01]  39,46.5 0 top
JP196  1  [1X01]  29,46.5 0 top
JP197  1  [1X01]  31.5,49 0 top
JP198  1  [1X01]  26.5,46.5 0 top
JP199  1  [1X01]  24,51.5 0 top
JP200  1  [1X01]  34,54 0 top
JP201  1  [1X01]  128.5,49 0 top
JP202  1  [1X01]  128.5,40 0 top
JP203  1  [1X01]  113.5,49 0 top
JP204  1  [1X01]  121,54 0 top
JP205  1  [1X01]  128.5,37.5 0 top
JP206  1  [1X01]  126,51.5 0 top
JP207  1  [1X01]  118,54 0 top
JP208  1  [1X01]  31.5,46.5 0 top
JP209  1  [1X01]  34,51.5 0 top
JP210  1  [1X01]  29,56.5 0 top
JP211  1  [1X01]  31.5,51.5 0 top
JP212  1  [1X01]  41.5,56.5 0 top
JP213  1  [1X01]  39,51.5 0 top
JP214  1  [1X01]  41.5,49 0 top
JP215  1  [1X01]  116,46.5 0 top
JP216  1  [1X01]  121,51.5 0 top
JP217  1  [1X01]  128.5,46.5 0 top
JP218  1  [1X01]  118.5,46.5 0 top
JP219  1  [1X01]  116,49 0 top
JP220  1  [1X01]  116,51.5 0 top
JP221  1  [1X01]  26.5,51.5 0 top
JP222  1  [1X01]  41.5,54 0 top
JP223  1  [1X01]  34,46.5 0 top
JP224  1  [1X01]  31.5,54 0 top
JP225  1  [1X01]  24,49 0 top
JP226  1  [1X01]  121,49 0 top
JP227  1  [1X01]  111,40 0 top
JP228  1  [1X01]  118.5,51.5 0 top
JP229  1  [1X01]  111,37.5 0 top
JP230  1  [1X01]  123.5,49 0 top
JP231  1  [1X01]  123.5,46.5 0 top
JP232  1  [1X01]  111,35 0 top
JP233  1  [1X01]  113.5,46.5 0 top
JP234  1  [1X01]  128.5,32.5 0 top
JP235  1  [1X01]  24,46.5 0 top
JP236  1  [1X01]  41.5,35 0 top
JP237  1  [1X01]  26.5,49 0 top
JP238  1  [1X01]  41.5,32.5 0 top
JP239  1  [1X01]  36.5,46.5 0 top
JP240  1  [1X01]  79.5,5.5 0 top
JP241  1  [1X01]  79.5,13 0 top
JP242  1  [1X01]  82,8 0 top
JP243  1  [1X01]  82,5.5 0 top
JP244  1  [1X01]  84.5,10.5 0 top
JP245  1  [1X01]  89.5,13 0 top
JP246  1  [1X01]  87,5.5 0 top
JP247  1  [1X01]  87,15.5 0 top
JP248  1  [1X01]  111,49 0 top
JP249  1  [1X01]  128.5,35 0 top
JP250  1  [1X01]  24,32.5 0 top
JP251  1  [1X01]  34,49 0 top
JP252  1  [1X01]  29,49 0 top
JP253  1  [1X01]  41.5,37.5 0 top
JP254  1  [1X01]  77,8 0 top
JP255  1  [1X01]  79.5,10.5 0 top
JP256  1  [1X01]  82,13 0 top
JP257  1  [1X01]  79.5,8 0 top
JP258  1  [1X01]  84.5,18 0 top
JP259  1  [1X01]  87,10.5 0 top
JP260  1  [1X01]  89.5,5.5 0 top
JP261  1  [1X01]  89.5,20.5 0 top
JP262  1  [1X01]  126,46.5 0 top
JP263  1  [1X01]  111,32.5 0 top
JP264  1  [1X01]  128.5,25 0 top
JP265  1  [1X01]  111,46.5 0 top
JP266  1  [1X01]  128.5,30 0 top
JP267  1  [1X01]  24,40 0 top
JP268  1  [1X01]  24,35 0 top
JP269  1  [1X01]  24,37.5 0 top
JP270  1  [1X01]  41.5,40 0 top
JP271  1  [1X01]  41.5,22.5 0 top
JP272  1  [1X01]  58,5.5 0 top
JP273  1  [1X01]  89.5,23 0 top
JP274  1  [1X01]  77,10.5 0 top
JP275  1  [1X01]  87,23 0 top
JP276  1  [1X01]  82,23 0 top
JP277  1  [1X01]  79.5,20.5 0 top
JP278  1  [1X01]  92,5.5 0 top
JP279  1  [1X01]  94.5,23 0 top
JP280  1  [1X01]  84.5,5.5 0 top
JP281  1  [1X01]  89.5,8 0 top
JP282  1  [1X01]  92,20.5 0 top
JP283  1  [1X01]  128.5,27.5 0 top
JP284  1  [1X01]  111,30 0 top
JP285  1  [1X01]  24,27.5 0 top
JP286  1  [1X01]  24,30 0 top
JP287  1  [1X01]  55.5,5.5 0 top
JP288  1  [1X01]  63,23 0 top
JP289  1  [1X01]  77,13 0 top
JP290  1  [1X01]  79.5,15.5 0 top
JP291  1  [1X01]  87,13 0 top
JP292  1  [1X01]  94.5,5.5 0 top
JP293  1  [1X01]  94.5,20.5 0 top
JP294  1  [1X01]  92,8 0 top
JP295  1  [1X01]  94.5,13 0 top
JP296  1  [1X01]  94.5,18 0 top
JP297  1  [1X01]  111,25 0 top
JP298  1  [1X01]  111,22.5 0 top
JP299  1  [1X01]  41.5,27.5 0 top
JP300  1  [1X01]  24,25 0 top
JP301  1  [1X01]  24,22.5 0 top
JP302  1  [1X01]  41.5,30 0 top
JP303  1  [1X01]  77,23 0 top
JP304  1  [1X01]  79.5,23 0 top
JP305  1  [1X01]  84.5,23 0 top
JP306  1  [1X01]  77,20.5 0 top
JP307  1  [1X01]  87,20.5 0 top
JP308  1  [1X01]  84.5,20.5 0 top
JP309  1  [1X01]  128.5,22.5 0 top
JP310  1  [1X01]  111,27.5 0 top
JP311  1  [1X01]  48,23 0 top
JP312  1  [1X01]  41.5,25 0 top
JP313  1  [1X01]  53,23 0 top
JP314  1  [1X01]  58,23 0 top
JP315  1  [1X01]  65.5,23 0 top
JP316  1  [1X01]  60.5,23 0 top
JP317  1  [1X01]  65.5,5.5 0 top
JP318  1  [1X01]  82,15.5 0 top
JP319  1  [1X01]  84.5,13 0 top
JP320  1  [1X01]  82,10.5 0 top
JP321  1  [1X01]  87,8 0 top
JP322  1  [1X01]  84.5,8 0 top
JP323  1  [1X01]  89.5,10.5 0 top
JP324  1  [1X01]  92,13 0 top
JP325  1  [1X01]  94.5,10.5 0 top
JP326  1  [1X01]  94.5,15.5 0 top
JP327  1  [1X01]  92,10.5 0 top
JP328  1  [1X01]  50.5,23 0 top
JP329  1  [1X01]  53,5.5 0 top
JP330  1  [1X01]  55.5,23 0 top
JP331  1  [1X01]  63,5.5 0 top
JP332  1  [1X01]  60.5,5.5 0 top
JP333  1  [1X01]  77,5.5 0 top
JP334  1  [1X01]  92,23 0 top
JP335  1  [1X01]  87,18 0 top
JP336  1  [1X01]  82,20.5 0 top
JP337  1  [1X01]  84.5,15.5 0 top
JP338  1  [1X01]  89.5,18 0 top
JP339  1  [1X01]  89.5,15.5 0 top
JP340  1  [1X01]  92,18 0 top
JP341  1  [1X01]  92,15.5 0 top
JP342  1  [1X01]  94.5,8 0 top
LED33  red  [CHIP-LED0603]  45,93 180 top
LED34  red  [CHIP-LED0603]  48,93 180 top
LED35  red  [CHIP-LED0603]  51.5,93 180 top
LED36  red  [CHIP-LED0603]  54.5,93 180 top
LED37  red  [CHIP-LED0603]  57.5,93 180 top
LED38  red  [CHIP-LED0603]  60.5,93 180 top
LED39  red  [CHIP-LED0603]  63.5,93 180 top
LED40  red  [CHIP-LED0603]  66.5,93 180 top
R1  10k  [RES-0402]  45,104.5 90 top
R2  10k  [RES-0402]  10,57.5 90 top
R3  10k  [RES-0402]  149,55 0 top
R4  0  [RES-0402]  5,46 180 top
R5  10k  [RES-0402]  5,49.5 180 top
R6  10k  [RES-0402]  149,51.5 0 top
R7  10k  [RES-0402]  149,58.5 0 top
R8  10k  [RES-0402]  149,62 0 top
R9  10k  [RES-0402]  149,65.5 0 top
R17  0  [RES-0402]  125,103.5 180 top
R18  0  [RES-0402]  108.5,100.5 180 top
R19  0  [RES-0402]  108.5,103.5 180 top
R20  0  [RES-0402]  125,100.5 180 top
R38  1k  [RES-0402]  66.5,96 270 top
R39  1k  [RES-0402]  63.5,96 270 top
R40  1k  [RES-0402]  60.5,96 270 top
R41  1k  [RES-0402]  57.5,96 270 top
R42  1k  [RES-0402]  54.5,96 270 top
R43  1k  [RES-0402]  51.5,96 270 top
R44  1k  [RES-0402]  48,96 270 top
R45  1k  [RES-0402]  45,96 270 top
SW1  SKQGADE010  [SW4-SMD-5.2X5.2X1.5MM]  5.5,55 0 top
SW2  SKQGADE010  [SW4-SMD-5.2X5.2X1.5MM]  40.5,102 0 top
U1  AMS1117-3.3  [SOT-223-3]  146.5,96 90 top
U2  AMS1117-2.5  [SOT-223-3]  130,96 90 top
U3  AMS1117-1.2  [SOT-223-3]  113.5,96 90 top
Y1  OSCILLATORSMD-5X3  [OSCILLATOR-SMD-5X3.2]  57.48,58.86 0 top